# EasyEDA Pro project V2.3.2 Core.epro, schematic V2.3.2 Schematic

## Sheets
1 Network MCU: Board Name: V2.3.2 Core; Create Date: 2024-07-26; Page Name: Network MCU; Project Name: Access Control Core; Schematic Name: V2.3.2 Schematic; Update Date: 2025-06-26
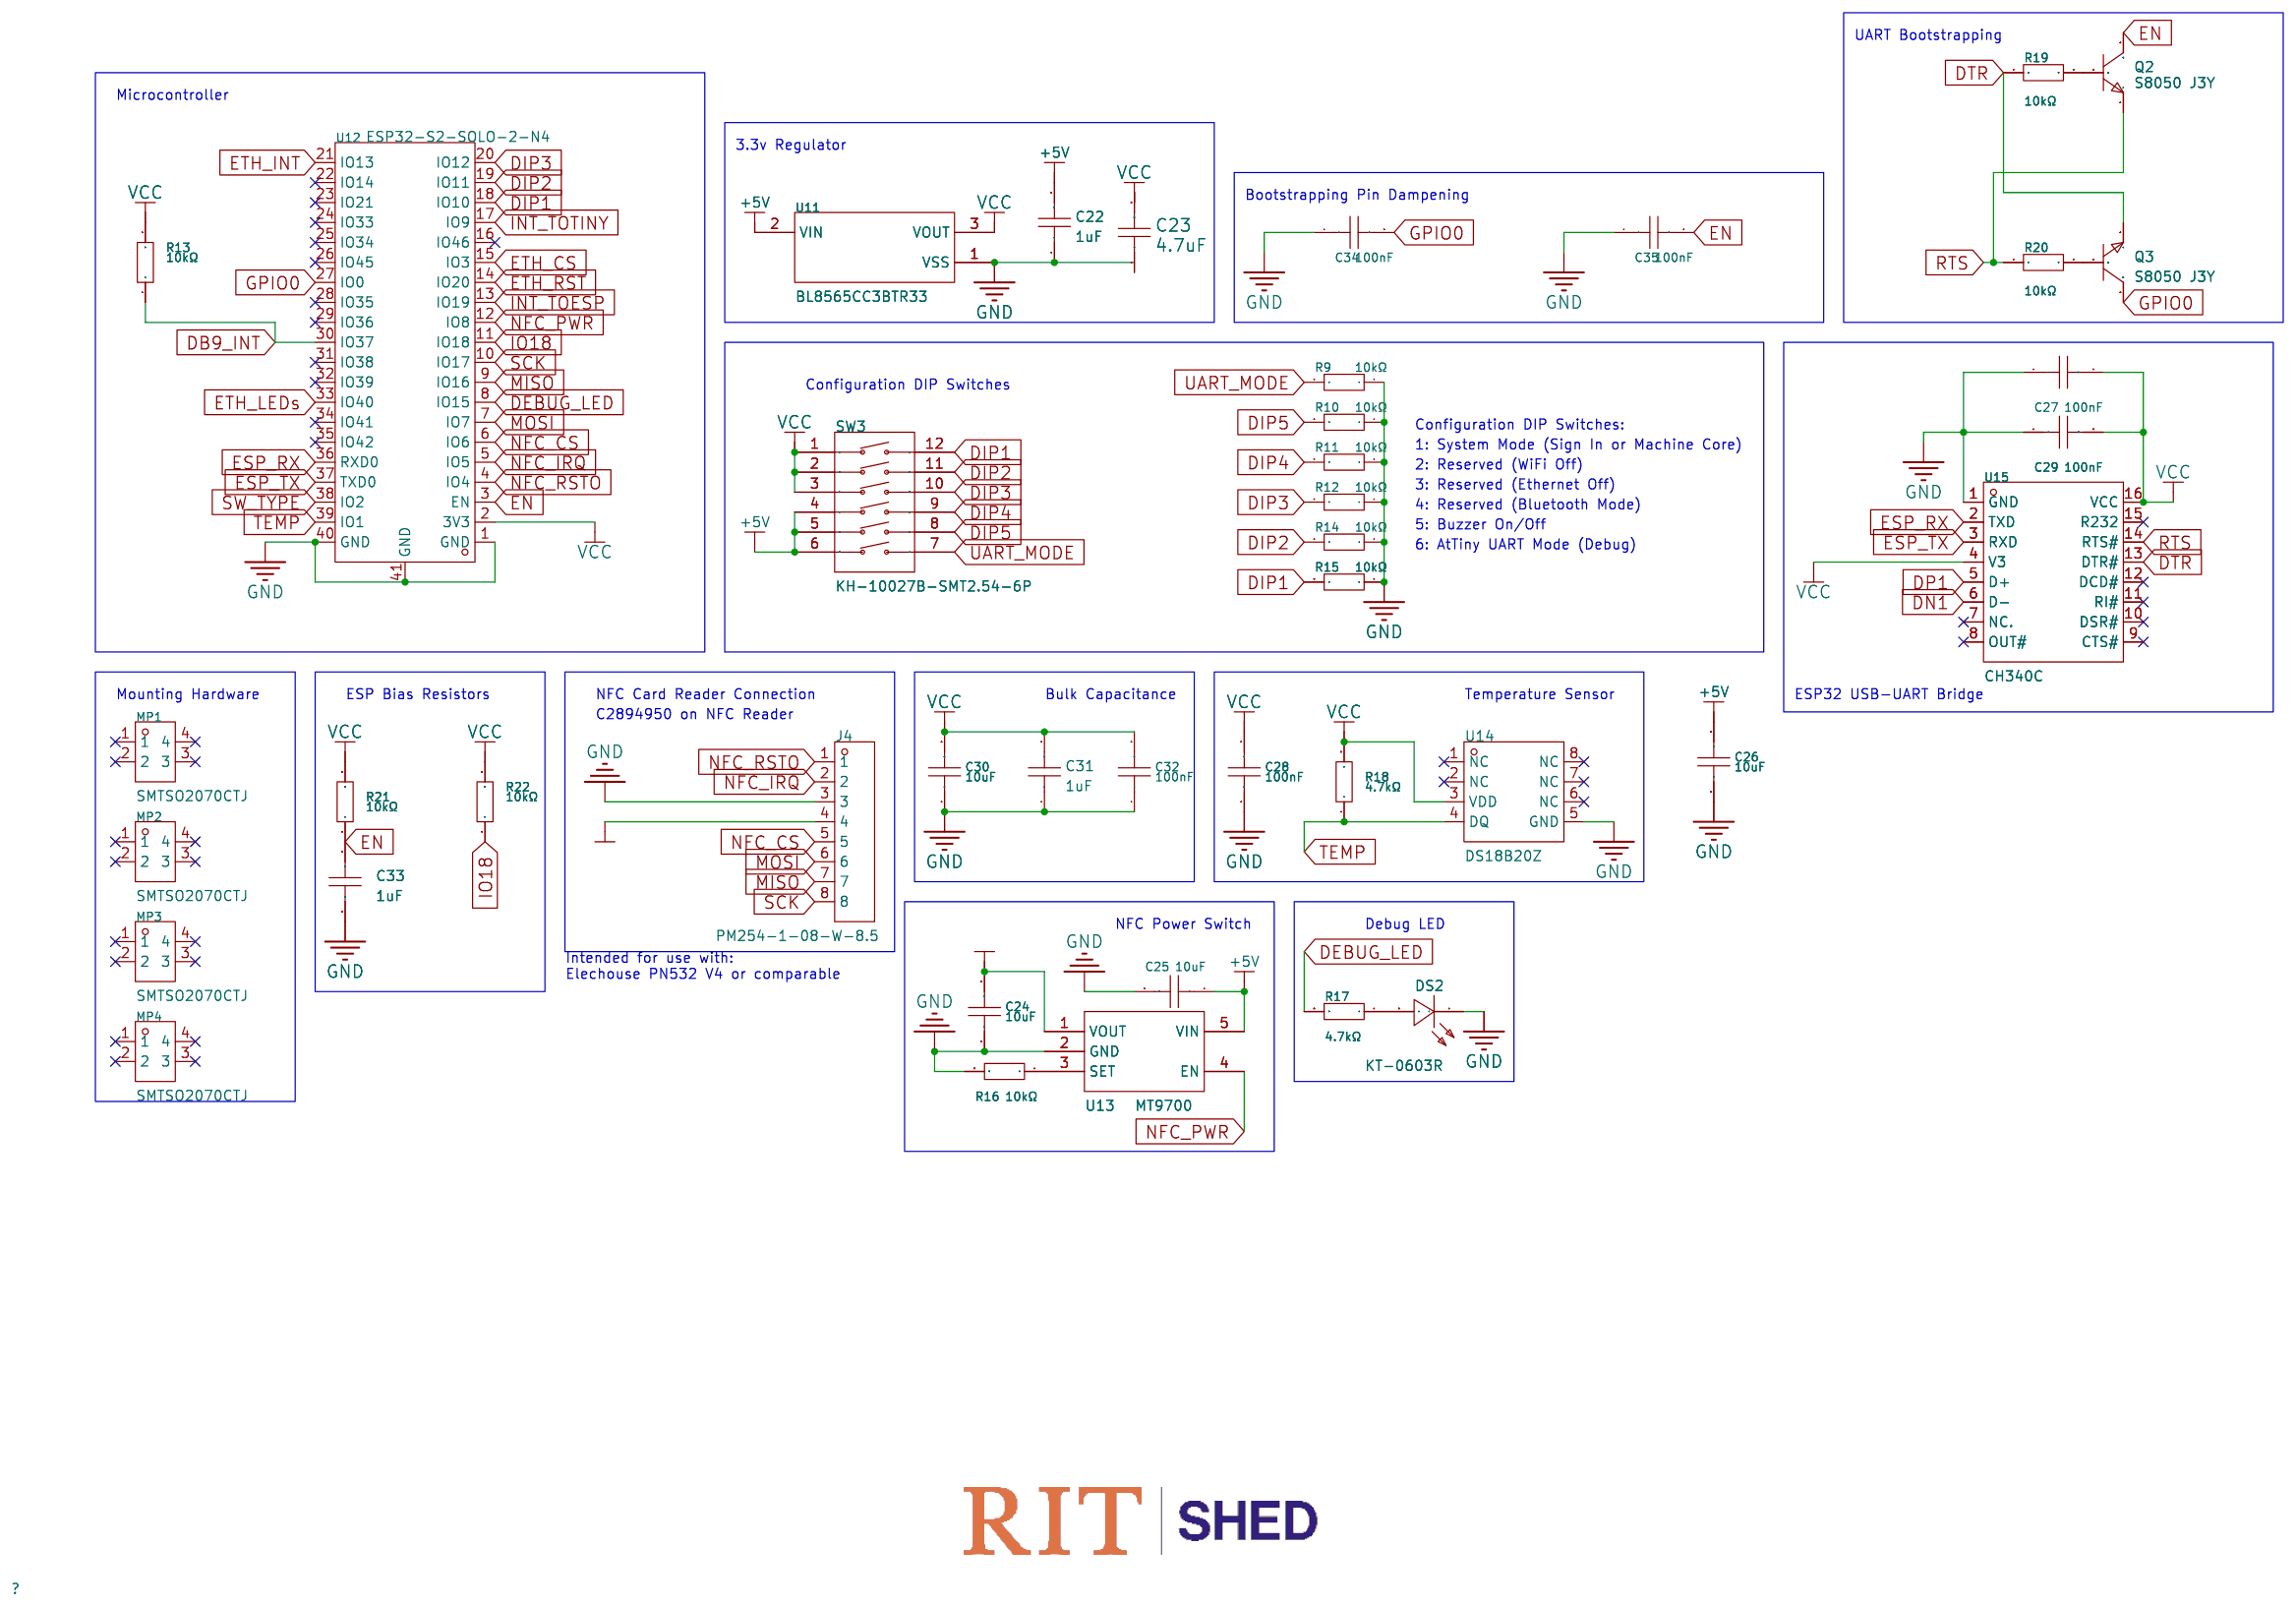
[diagram p0: Network MCU]
2 Front End: Page Name: Front End
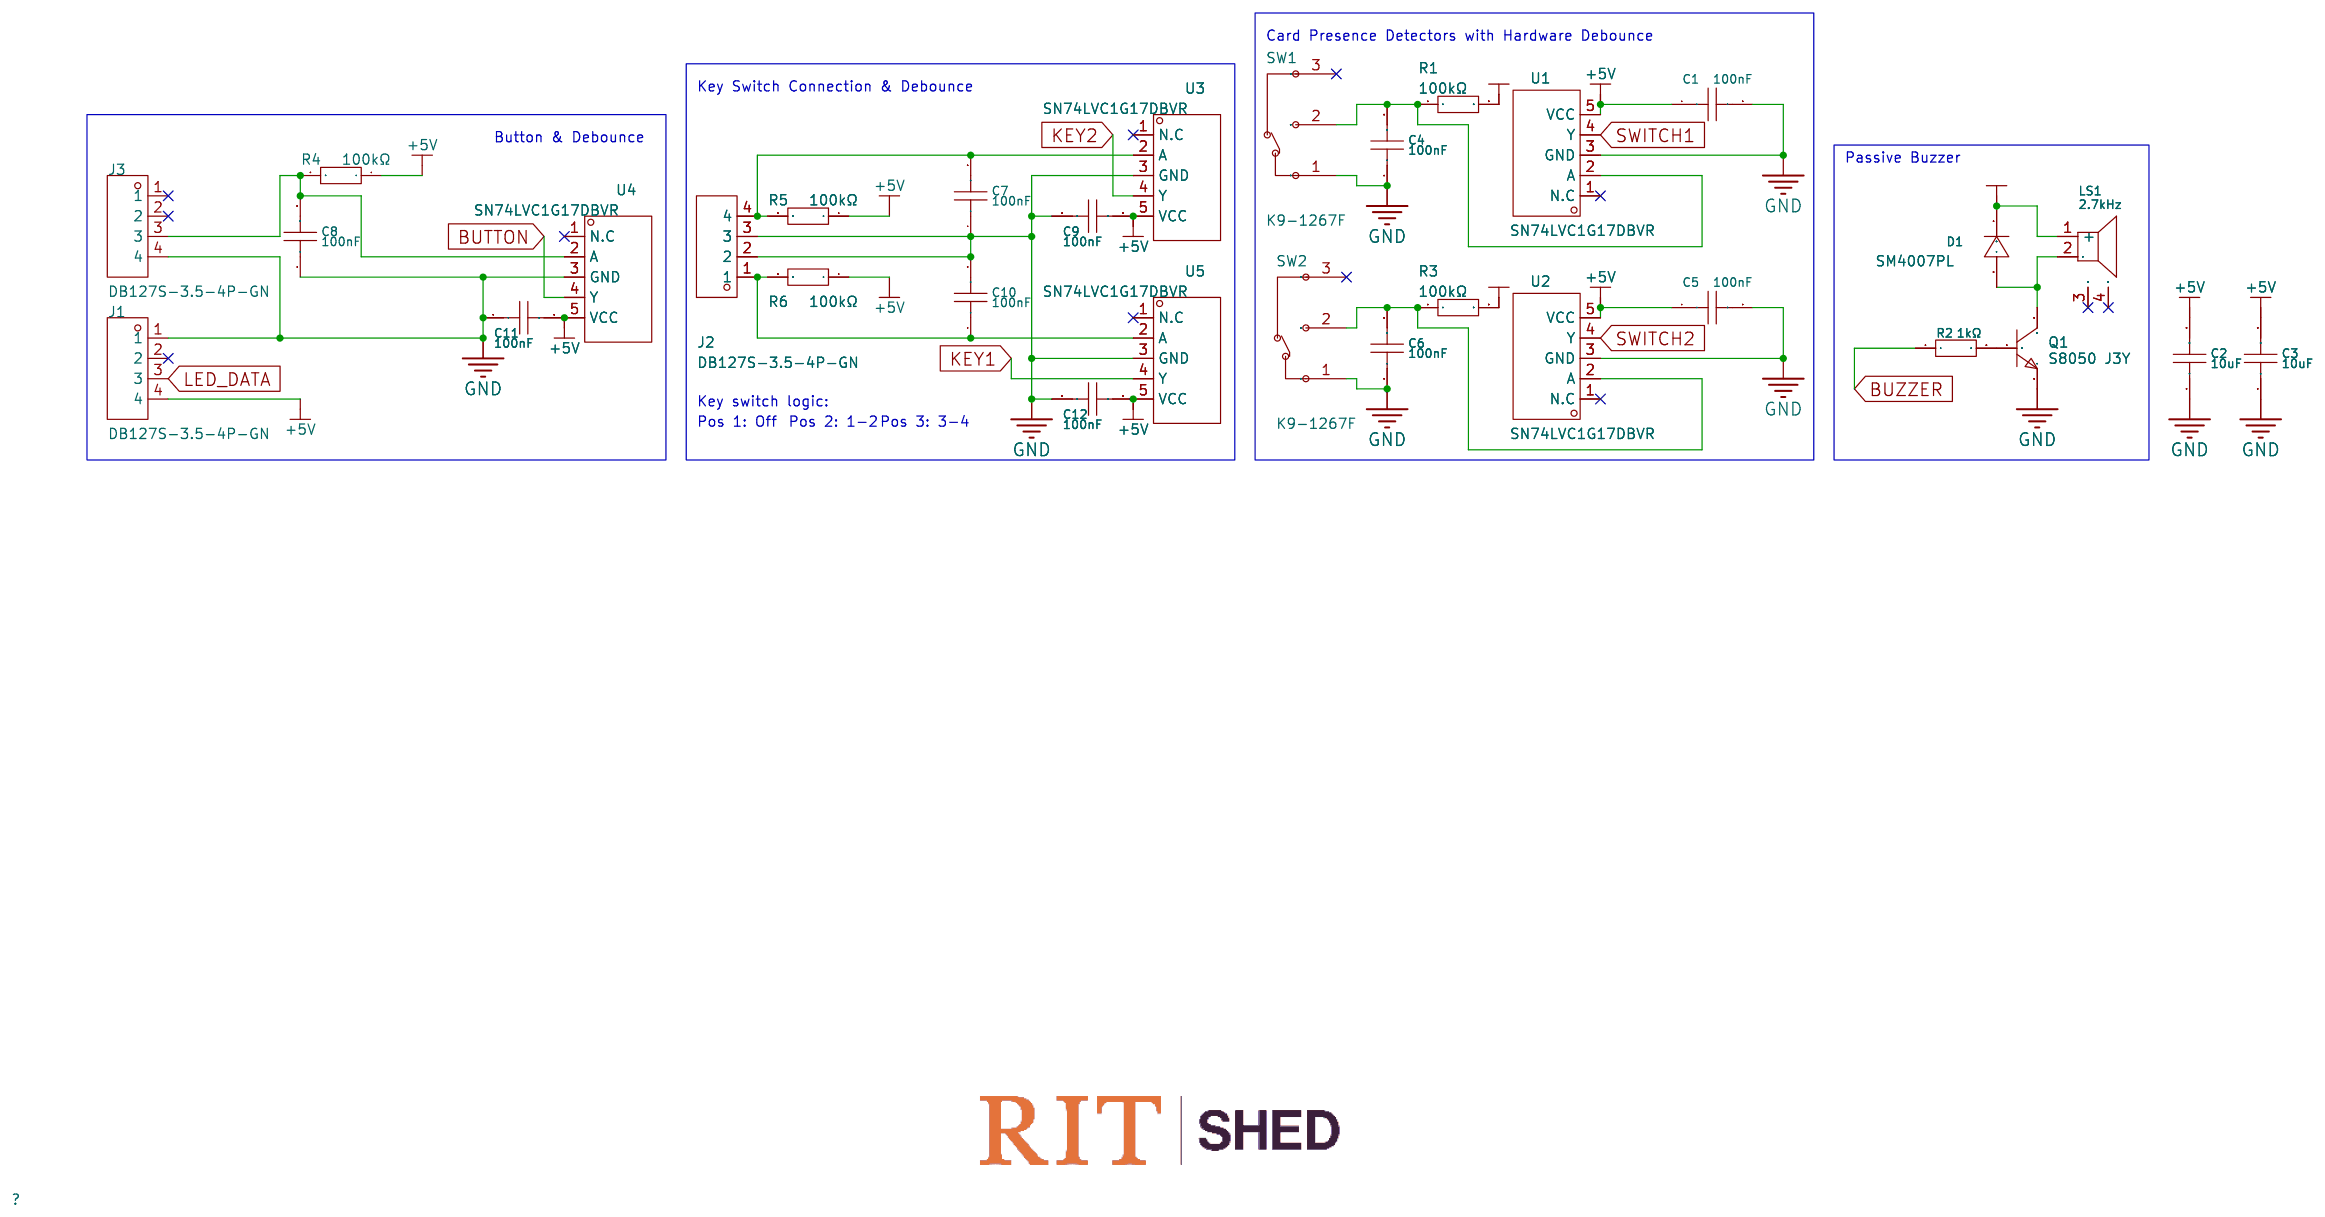
[diagram p1: Front End]
3 USB: Page Name: USB
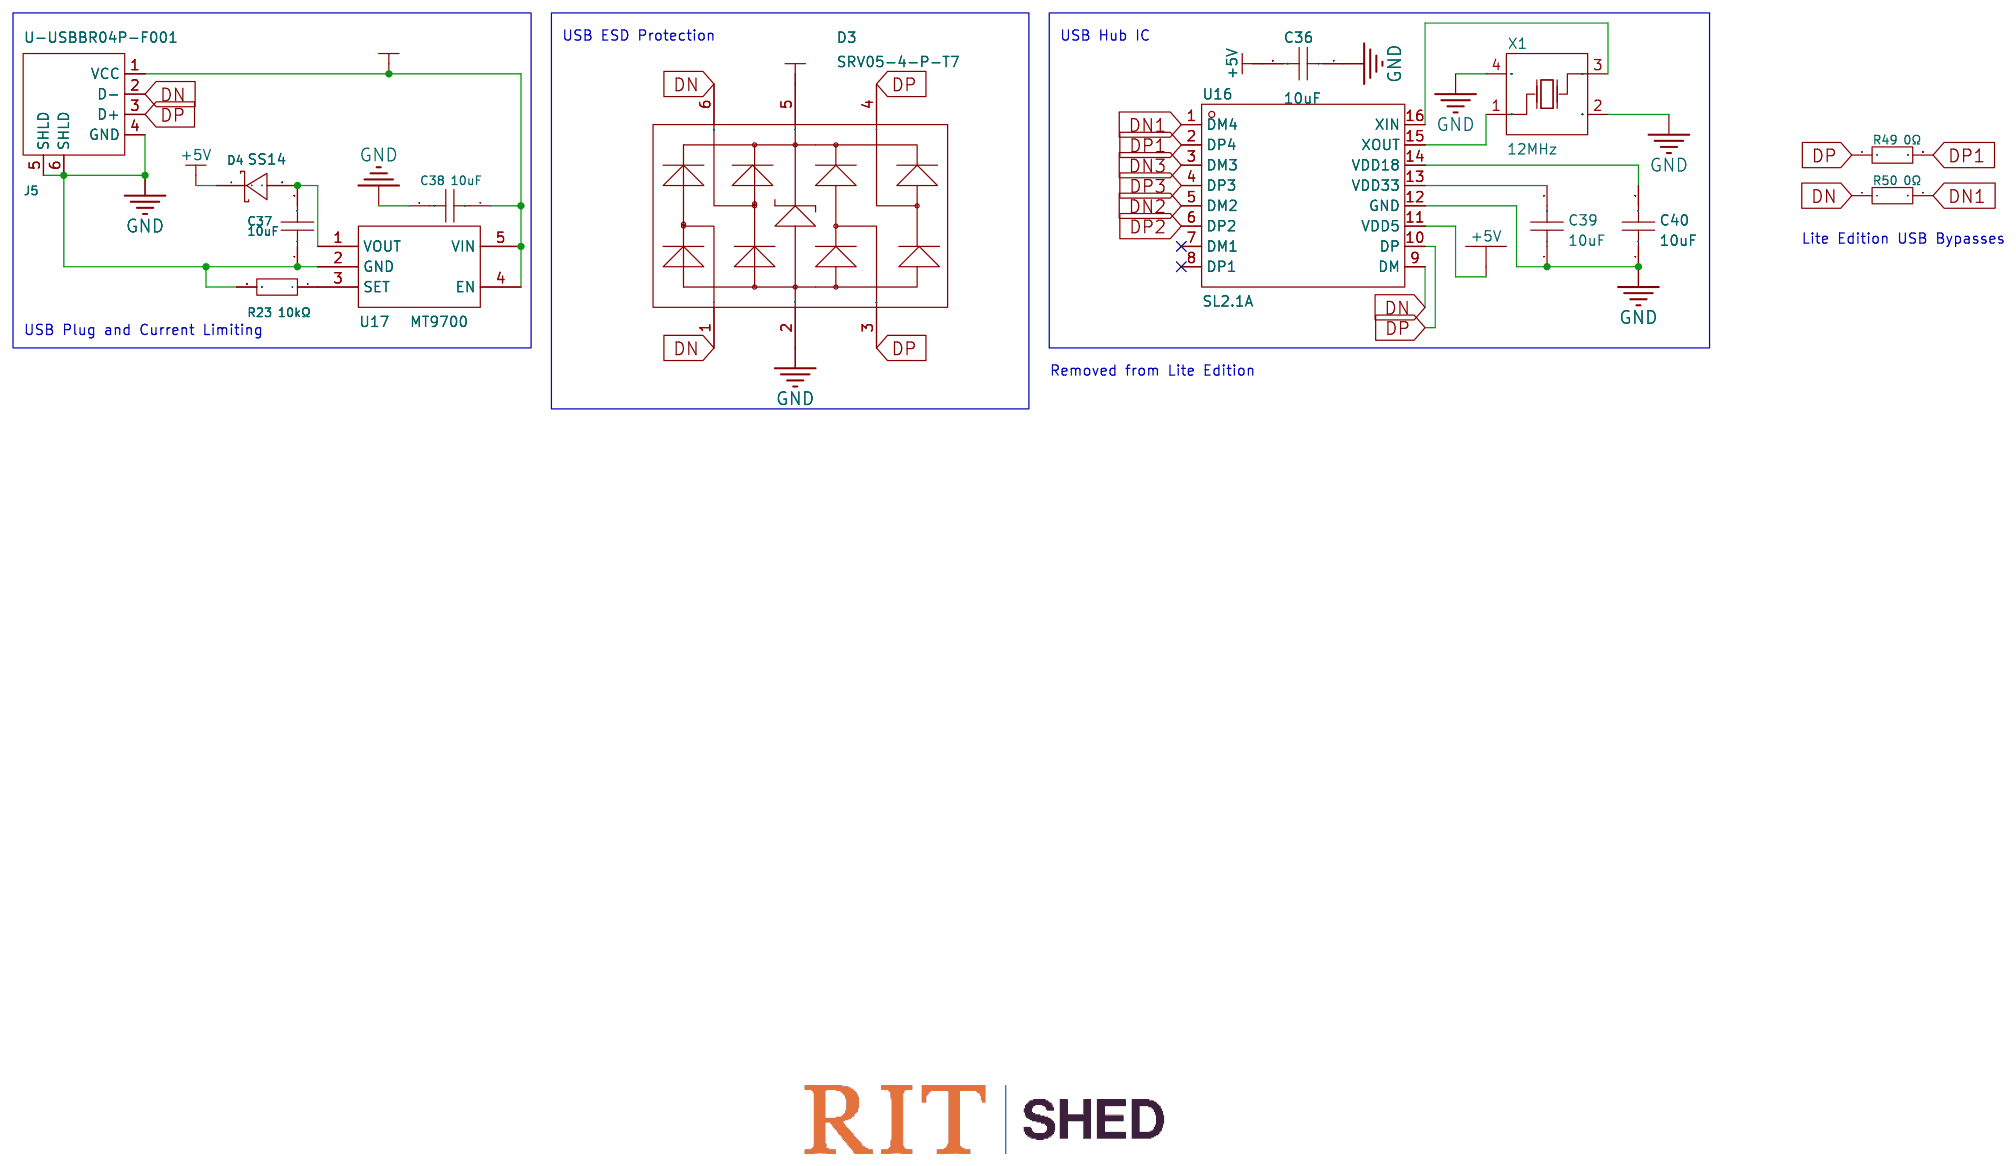
[diagram p2: USB]
4 Switch Interface: Page Name: Switch Interface
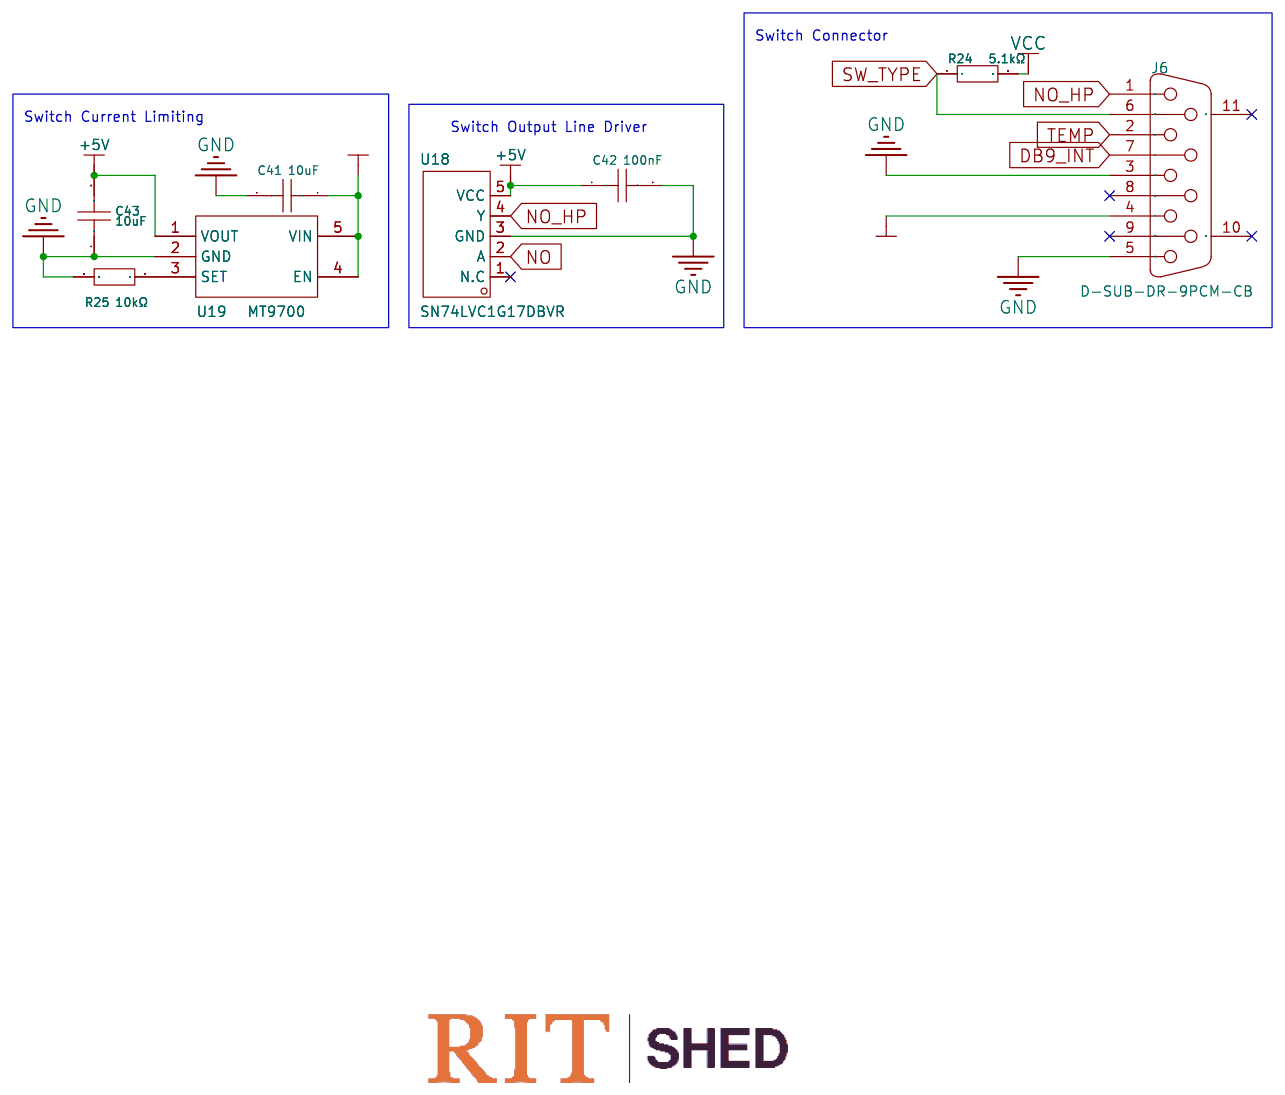
[diagram p3: Switch Interface]
5 Ethernet: Page Name: Ethernet
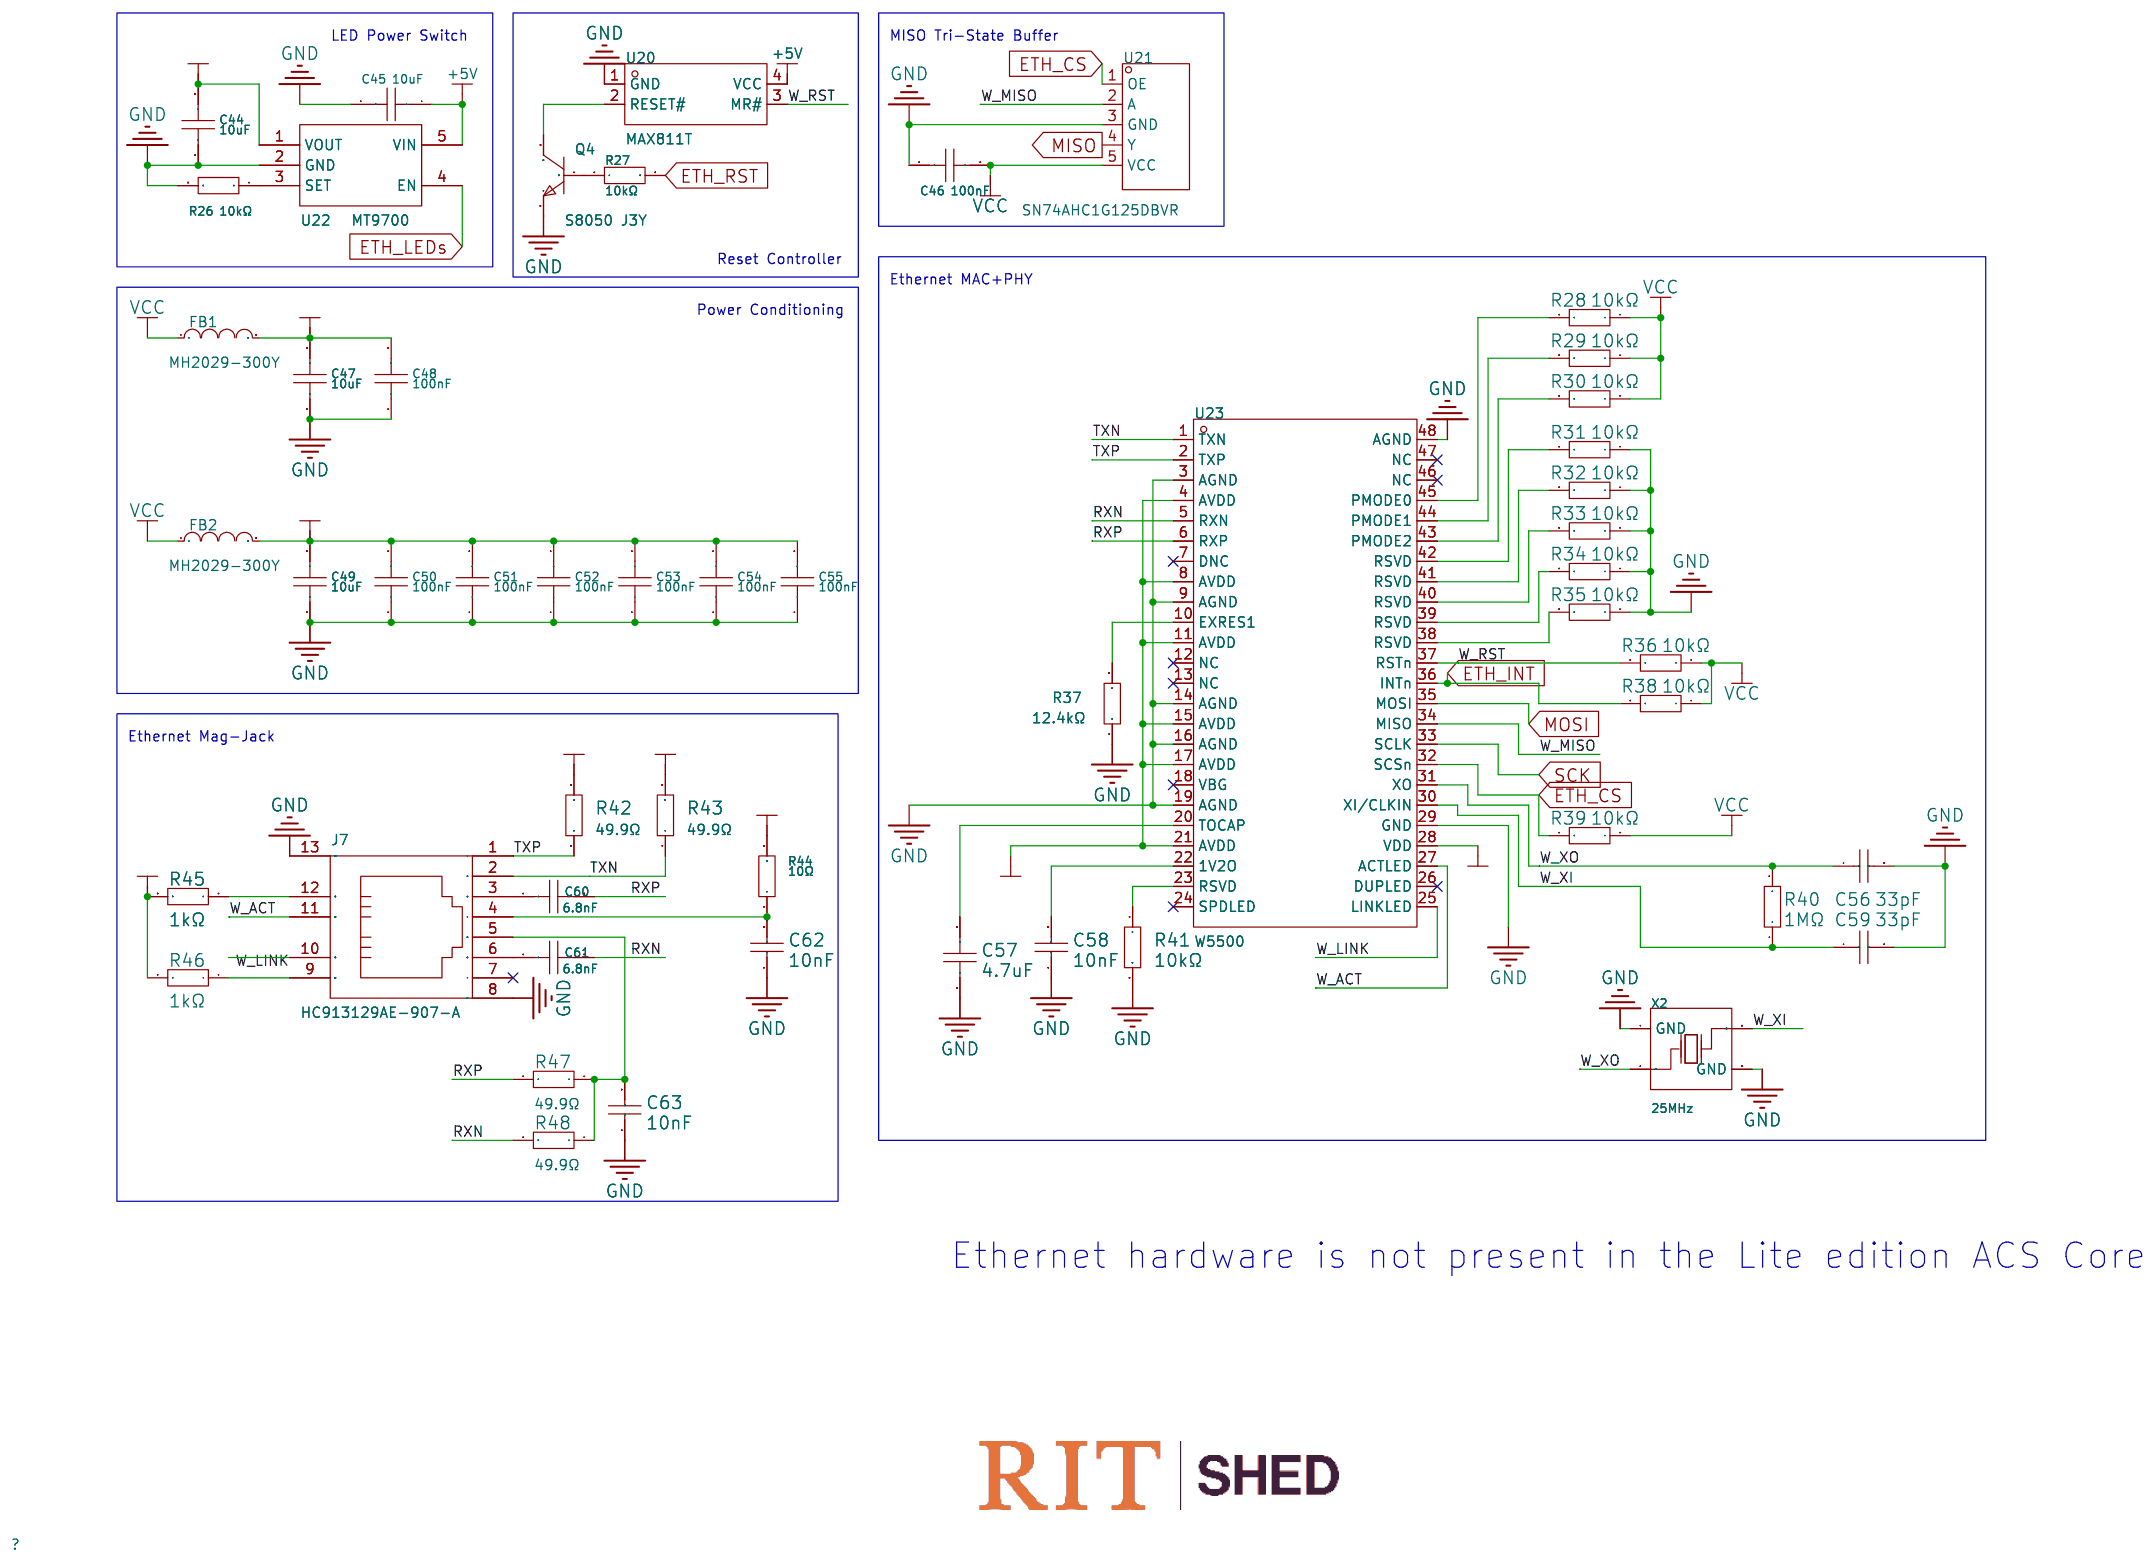
[diagram p4: Ethernet]
6 Front End MCU: Board Name: <System Assignment>; Page Name: Front End MCU
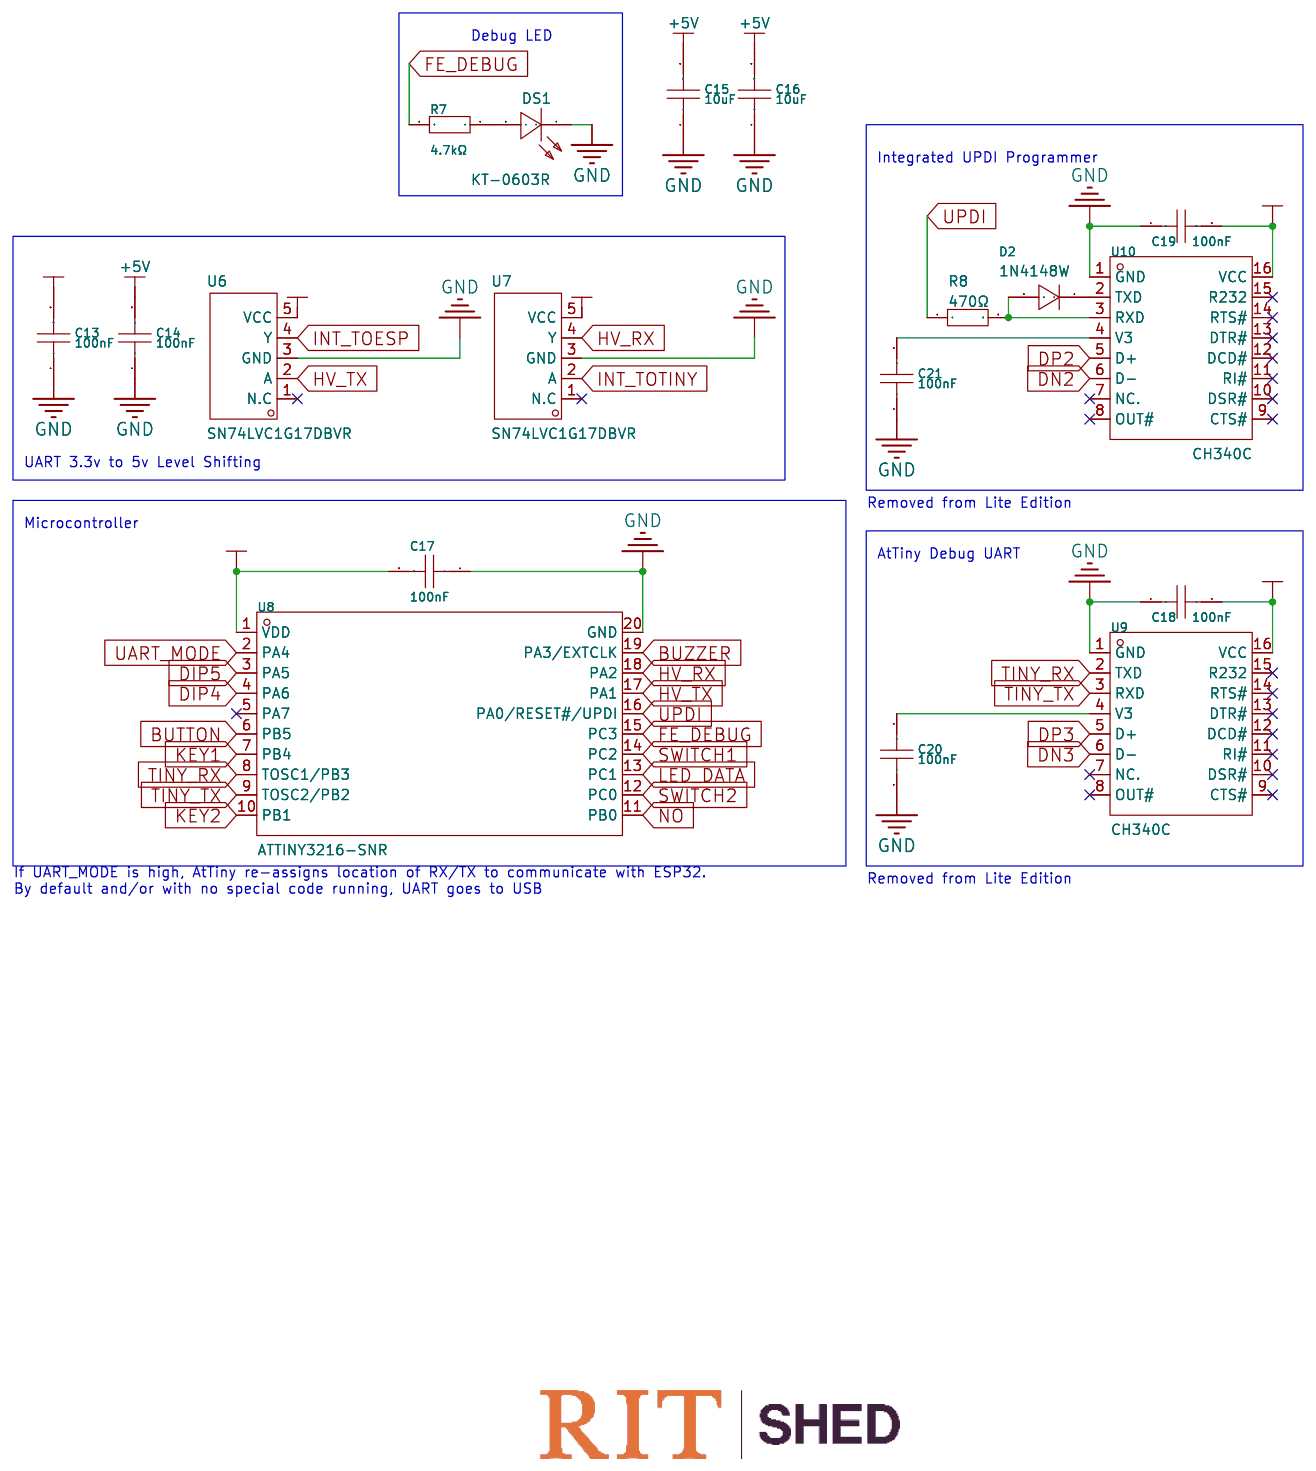
[diagram p5: Front End MCU]

## Parts
sheet Ethernet
C44  10uF  [C0603]  (no BOM)
C45  10uF  [C0603]  (no BOM)
C46  100nF  [C0603]  (no BOM)
C47  10uF  [C0603]  (no BOM)
C48  100nF  [C0603]  (no BOM)
C49  10uF  [C0603]  (no BOM)
C50  100nF  [C0603]  (no BOM)
C51  100nF  [C0603]  (no BOM)
C52  100nF  [C0603]  (no BOM)
C53  100nF  [C0603]  (no BOM)
C54  100nF  [C0603]  (no BOM)
C55  100nF  [C0603]  (no BOM)
C56  33pF  [C0603]  (no BOM)
C57  4.7uF  [C0603]  (no BOM)
C58  10nF  [C0603]  (no BOM)
C59  33pF  [C0603]  (no BOM)
C60  6.8nF  [C0603]  (no BOM)
C61  6.8nF  [C0603]  (no BOM)
C62  10nF  [C0603]  (no BOM)
C63  10nF  [C0603]  (no BOM)
FB1  MH2029-300Y  [L0805]  (no BOM)
FB2  MH2029-300Y  [L0805]  (no BOM)
J7  HC913129AE-907-A  [RJ45-TH_HC911102A-904-A]  (no BOM)
Q4  S8050 J3Y  [SOT-23-3_L3.0-W1.7-P0.95-LS2.9-BR]  (no BOM)
R26  10kΩ  [R0603]  (no BOM)
R27  10kΩ  [R0603]  (no BOM)
R28  10kΩ  [R0603]  (no BOM)
R29  10kΩ  [R0603]  (no BOM)
R30  10kΩ  [R0603]  (no BOM)
R31  10kΩ  [R0603]  (no BOM)
R32  10kΩ  [R0603]  (no BOM)
R33  10kΩ  [R0603]  (no BOM)
R34  10kΩ  [R0603]  (no BOM)
R35  10kΩ  [R0603]  (no BOM)
R36  10kΩ  [R0603]  (no BOM)
R37  12.4kΩ  [R0603]  (no BOM)
R38  10kΩ  [R0603]  (no BOM)
R39  10kΩ  [R0603]  (no BOM)
R40  1MΩ  [R0603]  (no BOM)
R41  10kΩ  [R0603]  (no BOM)
R42  49.9Ω  [R0603]  (no BOM)
R43  49.9Ω  [R0603]  (no BOM)
R44  10Ω  [R0603]  (no BOM)
R45  1kΩ  [R0603]  (no BOM)
R46  1kΩ  [R0603]  (no BOM)
R47  49.9Ω  [R0603]  (no BOM)
R48  49.9Ω  [R0603]  (no BOM)
U20  MAX811T  [SOT-143-4_L2.9-W1.3-P1.90-LS2.4-BL-1]  (no BOM)
U21  SN74AHC1G125DBVR  [SOT-23-5_L3.0-W1.7-P0.95-LS2.8-BR]  (no BOM)
U22  MT9700  [SOT-23-5_L3.0-W1.7-P0.95-LS2.8-BR]  (no BOM)
U23  W5500  [LQFP-48_L7.0-W7.0-P0.50-LS9.0-BL]  (no BOM)
X2  25MHz  [CRYSTAL-SMD_4P-L2.5-W2.0-BL]  (no BOM)
sheet Front End MCU
C13  100nF  [C0603]
C14  100nF  [C0603]
C15  10uF  [C0603]
C16  10uF  [C0603]
C17  100nF  [C0603]
C18  100nF  [C0603]  (no BOM)
C19  100nF  [C0603]  (no BOM)
C20  100nF  [C0603]  (no BOM)
C21  100nF  [C0603]  (no BOM)
D2  1N4148W  [SOD-123F_L2.7-W1.6-LS3.8-RD]  (no BOM)
DS1  KT-0603R  [LED0603-RD]
R7  4.7kΩ  [R0603]
R8  470Ω  [R0603]  (no BOM)
U6  SN74LVC1G17DBVR  [SOT-23-5_L3.0-W1.7-P0.95-LS2.8-BR]
U7  SN74LVC1G17DBVR  [SOT-23-5_L3.0-W1.7-P0.95-LS2.8-BR]
U8  ATTINY3216-SNR  [SOIC-20_L12.8-W7.5-P1.27-LS10.3-BL]
U9  CH340C  [SOP-16_L10.0-W3.9-P1.27-LS6.0-BL]  (no BOM)
U10  CH340C  [SOP-16_L10.0-W3.9-P1.27-LS6.0-BL]  (no BOM)
sheet Front End
C1  100nF  [C0603]
C2  10uF  [C0603]
C3  10uF  [C0603]
C4  100nF  [C0603]
C5  100nF  [C0603]
C6  100nF  [C0603]
C7  100nF  [C0603]
C8  100nF  [C0603]
C9  100nF  [C0603]
C10  100nF  [C0603]
C11  100nF  [C0603]
C12  100nF  [C0603]
D1  SM4007PL  [SOD-123F_L2.8-W1.8-LS3.7-RD]
J1  DB127S-3.5-4P-GN  [CONN-TH_4P-P3.50_DIBO_DB127S-3.5-4P-GN]
J2  DB127S-3.5-4P-GN  [CONN-TH_4P-P3.50_DIBO_DB127S-3.5-4P-GN]
J3  DB127S-3.5-4P-GN  [CONN-TH_4P-P3.50_DIBO_DB127S-3.5-4P-GN]
LS1  2.7kHz  [BUZ-SMD_4P-L8.5-W8.5-P8.50-TL]
Q1  S8050 J3Y  [SOT-23-3_L3.0-W1.7-P0.95-LS2.9-BR]
R1  100kΩ  [R0603]
R2  1kΩ  [R0603]
R3  100kΩ  [R0603]
R4  100kΩ  [R0603]
R5  100kΩ  [R0603]
R6  100kΩ  [R0603]
SW1  K9-1267F  [SW-TH_K9-1267F]
SW2  K9-1267F  [SW-TH_K9-1267F]
U1  SN74LVC1G17DBVR  [SOT-23-5_L3.0-W1.7-P0.95-LS2.8-BR]
U2  SN74LVC1G17DBVR  [SOT-23-5_L3.0-W1.7-P0.95-LS2.8-BR]
U3  SN74LVC1G17DBVR  [SOT-23-5_L3.0-W1.7-P0.95-LS2.8-BR]
U4  SN74LVC1G17DBVR  [SOT-23-5_L3.0-W1.7-P0.95-LS2.8-BR]
U5  SN74LVC1G17DBVR  [SOT-23-5_L3.0-W1.7-P0.95-LS2.8-BR]
sheet Network MCU
C22  1uF  [C0603]
C23  4.7uF  [C0603]
C24  10uF  [C0603]
C25  10uF  [C0603]
C26  10uF  [C0603]
C27  100nF  [C0603]
C28  100nF  [C0603]
C29  100nF  [C0603]
C30  10uF  [C0603]
C31  1uF  [C0603]
C32  100nF  [C0603]
C33  1uF  [C0603]
C34  100nF  [C0603]
C35  100nF  [C0603]
DS2  KT-0603R  [LED0603-RD]
J4  PM254-1-08-W-8.5  [HDR-TH_8P-P2.54-H-F-W10.0-N]
MP1  SMTSO2070CTJ  [SMD_BD5.6-L5.6-W5.6-D3.6]
MP2  SMTSO2070CTJ  [SMD_BD5.6-L5.6-W5.6-D3.6]
MP3  SMTSO2070CTJ  [SMD_BD5.6-L5.6-W5.6-D3.6]
MP4  SMTSO2070CTJ  [SMD_BD5.6-L5.6-W5.6-D3.6]
Q2  S8050 J3Y  [SOT-23-3_L3.0-W1.7-P0.95-LS2.9-BR]
Q3  S8050 J3Y  [SOT-23-3_L3.0-W1.7-P0.95-LS2.9-BR]
R9  10kΩ  [R0603]
R10  10kΩ  [R0603]
R11  10kΩ  [R0603]
R12  10kΩ  [R0603]
R13  10kΩ  [R0603]
R14  10kΩ  [R0603]
R15  10kΩ  [R0603]
R16  10kΩ  [R0603]
R17  4.7kΩ  [R0603]
R18  4.7kΩ  [R0603]
R19  10kΩ  [R0603]
R20  10kΩ  [R0603]
R21  10kΩ  [R0603]
R22  10kΩ  [R0603]
SW3  KH-10027B-SMT2.54-6P  [SW-SMD_KINGHELM_KH-10027B-SMT2.54-6P]
U11  BL8565CC3BTR33  [SOT-89-3_L4.5-W2.5-P1.50-LS4.2-BR]
U12  2.4GHz  [WIRELM-SMD_ESP32-S3-WROOM-1]
U13  MT9700  [SOT-23-5_L3.0-W1.7-P0.95-LS2.8-BR]
U14  DS18B20Z  [SOP-8_L4.9-W3.9-P1.27-LS6.0-BL]
U15  CH340C  [SOP-16_L10.0-W3.9-P1.27-LS6.0-BL]
sheet Switch Interface
C41  10uF  [C0603]
C42  100nF  [C0603]
C43  10uF  [C0603]
J6  D-SUB-DR-9PCM-CB  [DB9-TH_D-SUB-DR-9PCM-CB]
R24  5.1kΩ  [R0603]
R25  10kΩ  [R0603]
U18  SN74LVC1G17DBVR  [SOT-23-5_L3.0-W1.7-P0.95-LS2.8-BR]
U19  MT9700  [SOT-23-5_L3.0-W1.7-P0.95-LS2.8-BR]
sheet USB
C36  10uF  [C0603]  (no BOM)
C37  10uF  [C0603]
C38  10uF  [C0603]
C39  10uF  [C0603]  (no BOM)
C40  10uF  [C0603]  (no BOM)
D3  SRV05-4-P-T7  [SOT-23-6_L2.9-W1.6-P0.95-LS2.8-BR]
D4  SS14  [SMA_L4.2-W2.6-LS5.3-RD]
J5  U-USBBR04P-F001  [USB-B-TH_U241-041N-1BR85-1]
R23  10kΩ  [R0603]
R49  0Ω  [R0603]
R50  0Ω  [R0603]
U16  SL2.1A  [SOP-16_L10.0-W3.9-P1.27-LS6.0-BL]  (no BOM)
U17  MT9700  [SOT-23-5_L3.0-W1.7-P0.95-LS2.8-BR]
X1  12MHz  [OSC-SMD_4P-L3.2-W2.5-BL]  (no BOM)

## Library data of the parts
C2 C3 C15 C16 C24-C26 C30 C37 C38 C41 C43-C45 C47 C49 = CL10A106MA8NRNC: Capacitance: Tolerance:±20% Tolerance:±20% Voltage Rated: Temperature Coefficient:; LCSC Part Name: 10uF ±20% 25V; Supplier Part: C96446; Manufacturer: SAMSUNG(三星); Supplier Footprint: 0603; JLCPCB Part Class: Basic Part; Datasheet: https://atta.szlcsc.com/upload/public/pdf/source/20160218/1457707763339.pdf; Supplier: LCSC; Tolerance: ±20%
C1 C4-C14 C17-C21 C27-C29 C32 C34 C35 C42 C46 C48 C50-C55 = CC0603KRX7R9BB104: Capacitance: Tolerance:±10% Tolerance:±10% Voltage Rated: Temperature Coefficient:; LCSC Part Name: 100nF ±10% 50V; Supplier Part: C14663; Manufacturer: YAGEO(国巨); Supplier Footprint: 0603; JLCPCB Part Class: Basic Part; Datasheet: https://atta.szlcsc.com/upload/public/pdf/source/20180910/C282072_33301C7F631E79921B82A8DAC6BCC5B3.pdf; Supplier: LCSC; Tolerance: ±10%
C56 C59 = CL10C330JB8NNNC: Capacitance: Tolerance:±5% Tolerance:±5% Voltage Rated: Temperature Coefficient:; LCSC Part Name: 33pF ±5% 50V; Supplier Part: C1663; Manufacturer: SAMSUNG(三星); Supplier Footprint: 0603; JLCPCB Part Class: Basic Part; Datasheet: https://atta.szlcsc.com/upload/public/pdf/source/20160218/1457707763339.pdf; Supplier: LCSC; Tolerance: ±5%
C23 C57 = CL10A475KO8NNNC: Capacitance: Tolerance:±10% Tolerance:±10% Voltage Rated: Temperature Coefficient:; LCSC Part Name: 4.7uF ±10% 16V; Supplier Part: C19666; Manufacturer: SAMSUNG(三星); Supplier Footprint: 0603; JLCPCB Part Class: Basic Part; Datasheet: https://atta.szlcsc.com/upload/public/pdf/source/20160218/1457707763339.pdf; Supplier: LCSC; Tolerance: ±10%
C58 C62 C63 = 0603B103K500NT: Capacitance:10nF Tolerance:±10% Tolerance:±10% Voltage Rated: Temperature Coefficient:; LCSC Part Name: 10nF ±10% 50V; Supplier Part: C57112; Manufacturer: FH(风华); Supplier Footprint: 0603; JLCPCB Part Class: Basic Part; Datasheet: https://atta.szlcsc.com/upload/public/pdf/source/20200305/C486355_26A10D38EF8C2A5C37091D0039909270.pdf; Supplier: LCSC; Tolerance: ±10%
C60 C61 = C1608X7R2A682KT000N: Capacitance: Tolerance:±10% Tolerance:±10% Voltage Rated: Temperature Coefficient:; LCSC Part Name: 6.8nF ±10% 100V; Supplier Part: C694293; Manufacturer: TDK; Supplier Footprint: 0603; JLCPCB Part Class: Extended Part; Datasheet: https://atta.szlcsc.com/upload/public/pdf/source/20191129/C465875_2B14C4D62A20D308712483249251ED98.pdf; Supplier: LCSC; Tolerance: ±10%
FB1 FB2 = MH2029-300Y: Impedance @ Frequency:30Ω@100MHz Tolerance:±25% Tolerance:±25% DC Resistance:25mΩ Current Rating:3A Circuits:1; LCSC Part Name: 单路 0805磁珠 阻抗30Ω@100MHz; Supplier Part: C840593; Manufacturer: BOURNS; Supplier Footprint: 0805; JLCPCB Part Class: Extended Part; Datasheet: https://atta.szlcsc.com/upload/public/pdf/source/20200907/C780182_6AA2A849D07FE675FBDEC0D82719ED6E.pdf; Supplier: LCSC; Impedance @ Frequency: 30Ω@100MHz; Tolerance: ±25%; DC Resistance: 25mΩ; Current Rating: 3A; Circuits: 1
J7 = HC913129AE-907-A: Connector Type:RJ45Receptacle Number of Ports:1 Mounting Style:Right-Angle Shielding:有屏蔽 LED:WithLED Contact Material:Phosphor bronze Contact Plating:Gold Operating Temperature Range:-40℃~+85℃ Operating Temperature Range:-40℃~+85℃ Soldering Temperature(Ma; LCSC Part Name: 弯插 带LED; Supplier Part: C5341218; Manufacturer: HCTL(华灿天禄); Supplier Footprint: 插件; JLCPCB Part Class: Extended Part; Datasheet: https://atta.szlcsc.com/upload/public/pdf/source/20230620/1EF30919FD4FC73383A5674A58476AE5.pdf; Supplier: LCSC; Connector Type: RJ45Receptacle; Number of Ports: 1; Mounting Style: Right-Angle; Shielding: 有屏蔽; LED: WithLED; Contact Material: Phosphor bronze; Contact Plating: Gold; Operating Temperature Range: -40℃~+85℃; Soldering Temperature(Max): 260℃@5S
Q1-Q4 = S8050 J3Y_C2146: Transistor Type: Collector Current (Ic): Collector-Emitter Breakdown Voltage (Vceo): Power Dissipation (Pd): DC Current Gain (hFE@Ic,Vce):200@50mA,1V DC Current Gain (hFE@Ic,Vce):200@50mA,1V Transition Frequency (fT):150MHz Collector Cut-Off Current (Icbo; LCSC Part Name: S8050 J3Y(RANGE:200-350) H档(200-350); Supplier Part: C2146; Manufacturer: CJ(江苏长电/长晶); Supplier Footprint: SOT-23; JLCPCB Part Class: Basic Part; Datasheet: https://atta.szlcsc.com/upload/public/pdf/source/20140809/1457707209234.pdf; Supplier: LCSC; DC Current Gain (hFE@Ic,Vce): 200@50mA,1V; Transition Frequency (fT): 150MHz; Collector Cut-Off Current (Icbo): 100nA; Collector-Emitter Saturation Voltage (VCE(sat)@Ic,Ib): 600mV@500mA,50mA
R9-R16 R19-R23 R25-R36 R38 R39 R41 = 0603WAF1002T5E: Type:Thick Film Resistors Resistance:10kΩ Tolerance:±1% Tolerance:±1% Power(Watts): Overload Voltage (Max): Temperature Coefficient:±100ppm/℃ Temperature Coefficient:±100ppm/℃ Operating Temperature Range:-55℃~+155℃ Operating Temperature Range:-55℃~+155℃; LCSC Part Name: 厚膜电阻 10kΩ ±1% 100mW; Supplier Part: C25804; Manufacturer: UNI-ROYAL(厚声); Supplier Footprint: 0603; JLCPCB Part Class: Basic Part; Datasheet: https://atta.szlcsc.com/upload/public/pdf/source/20200306/C422600_1E6D84923E4A46A82E41ADD87F860B5C.pdf; Supplier: LCSC; Type: Thick Film Resistors; Tolerance: ±1%; Temperature Coefficient: ±100ppm/℃; Operating Temperature Range: -55℃~+155℃
R37 = RTT031242FTP: Type:Thick Film Resistors Resistance: Tolerance:±1% Tolerance:±1% Power(Watts): Overload Voltage (Max): Temperature Coefficient:±100ppm/℃ Temperature Coefficient:±100ppm/℃ Operating Temperature Range:-55℃~+155℃ Operating Temperature Range:-55℃~+155℃; LCSC Part Name: 厚膜电阻 12.4kΩ ±1% 100mW; Supplier Part: C103261; Manufacturer: RALEC(旺诠); Supplier Footprint: 0603; JLCPCB Part Class: Extended Part; Datasheet: https://atta.szlcsc.com/upload/public/pdf/source/20191219/C158410_884373A5B7E1BC76BF57BC45A946C093.pdf; Supplier: LCSC; Type: Thick Film Resistors; Tolerance: ±1%; Temperature Coefficient: ±100ppm/℃; Operating Temperature Range: -55℃~+155℃
R40 = 0603WAF1004T5E: Type:Thick Film Resistors Resistance:1MΩ Tolerance:±1% Tolerance:±1% Power(Watts): Overload Voltage (Max): Temperature Coefficient:±100ppm/℃ Temperature Coefficient:±100ppm/℃ Operating Temperature Range:-55℃~+155℃ Operating Temperature Range:-55℃~+155℃; LCSC Part Name: 1MΩ ±1% 100mW 厚膜电阻; Supplier Part: C22935; Manufacturer: UNI-ROYAL(厚声); Supplier Footprint: 0603; JLCPCB Part Class: Basic Part; Datasheet: https://atta.szlcsc.com/upload/public/pdf/source/20200306/C422600_1E6D84923E4A46A82E41ADD87F860B5C.pdf; Supplier: LCSC; Type: Thick Film Resistors; Tolerance: ±1%; Temperature Coefficient: ±100ppm/℃; Operating Temperature Range: -55℃~+155℃
R42 R43 R47 R48 = RC0603DR-0749R9L: 100mW Thick Film Resistors ±100ppm/℃ ±0.5% 49.9Ω 0603  Chip Resistor - Surface Mount ROHS; LCSC Part Name: C859049; Supplier Part: C859049; Manufacturer: UNI-ROYAL(厚声); Manufacturer Part: 0603WAF1002T5E; Supplier Footprint: 0603; JLCPCB Part Class: Extended Part; Datasheet: https://atta.szlcsc.com/upload/public/pdf/source/20200306/C422600_1E6D84923E4A46A82E41ADD87F860B5C.pdf; Supplier: LCSC; Type: Thick Film Resistors; Tolerance: ±1%; Temperature Coefficient: ±100ppm/℃; Operating Temperature Range: -55℃~+155℃
R44 = 0603WAF100JT5E: Type:Thick Film Resistors Resistance:10Ω Tolerance:±1% Tolerance:±1% Power(Watts): Overload Voltage (Max): Temperature Coefficient:±400ppm/℃ Temperature Coefficient:±400ppm/℃ Operating Temperature Range:-55℃~+155℃ Operating Temperature Range:-55℃~+155℃; LCSC Part Name: 10Ω ±1% 100mW 厚膜电阻; Supplier Part: C22859; Manufacturer: UNI-ROYAL(厚声); Supplier Footprint: 0603; JLCPCB Part Class: Basic Part; Datasheet: https://atta.szlcsc.com/upload/public/pdf/source/20200306/C422600_1E6D84923E4A46A82E41ADD87F860B5C.pdf; Supplier: LCSC; Type: Thick Film Resistors; Tolerance: ±1%; Temperature Coefficient: ±400ppm/℃; Operating Temperature Range: -55℃~+155℃
R2 R45 R46 = 0603WAF1001T5E: Type:Thick Film Resistors Resistance:1kΩ Tolerance:±1% Tolerance:±1% Power(Watts): Overload Voltage (Max): Temperature Coefficient:±100ppm/℃ Temperature Coefficient:±100ppm/℃ Operating Temperature Range:-55℃~+155℃ Operating Temperature Range:-55℃~+155℃; LCSC Part Name: 1kΩ ±1% 100mW 厚膜电阻; Supplier Part: C21190; Manufacturer: UNI-ROYAL(厚声); Supplier Footprint: 0603; JLCPCB Part Class: Basic Part; Datasheet: https://atta.szlcsc.com/upload/public/pdf/source/20200306/C422600_1E6D84923E4A46A82E41ADD87F860B5C.pdf; Supplier: LCSC; Type: Thick Film Resistors; Tolerance: ±1%; Temperature Coefficient: ±100ppm/℃; Operating Temperature Range: -55℃~+155℃
U20 = MAX811T: Supplier Part: C19631730; Manufacturer: TECH PUBLIC(台舟); Supplier Footprint: SOT-143; JLCPCB Part Class: Extended Part; Datasheet: https://wmsc.lcsc.com/wmsc/upload/file/pdf/v2/lcsc/2404012050_GR-MAX811T_C19631730.pdf; Supplier: LCSC
U21 = SN74AHC1G125DBVR: Input type:- output type:Tri-State Supply Voltage:2V~5.5V Supply Voltage:2V~5.5V Number of Elements:1 Number of Bits per Element:1 Sink Current:8mA Source Current:8mA Logic Family:74AHC Operating Temperature:-40℃~+125℃ Operating Temperature:-40℃~+125℃; Supplier Part: C7468; Manufacturer: TI(德州仪器); Supplier Footprint: SOT-23-5; JLCPCB Part Class: Extended Part; Datasheet: https://www.ti.com/cn/lit/gpn/sn74ahc1g125; Supplier: LCSC; output type: Tri-State; Supply Voltage: 2V~5.5V; Number of Elements: 1; Number of Bits per Element: 1; Sink Current: 8mA; Source Current: 8mA; Logic Family: 74AHC; Operating Temperature: -40℃~+125℃
U13 U17 U19 U22 = MT9700: Supplier Part: C89855; Manufacturer: 西安航天民芯; Supplier Footprint: SOT-23-5; JLCPCB Part Class: Extended Part; Datasheet: https://atta.szlcsc.com/upload/public/pdf/source/20170418/1492481333031.pdf; Supplier: LCSC
U23 = W5500: LCSC Part Name: 硬连线TCP/IP嵌入式以太网控制器; Supplier Part: C32843; Manufacturer: WIZNET; Supplier Footprint: LQFP-48(7x7); JLCPCB Part Class: Extended Part; Datasheet: https://atta.szlcsc.com/upload/public/pdf/source/20230714/E10C32B058E0BA54FCE1C1556BE10C07.pdf; Supplier: LCSC
X2 = 7E25000E20UCG: Crystal Type:贴片晶振 Frequency: Normal temperature Frequency Tolerance:±10ppm Normal temperature Frequency Tolerance:±10ppm External load capacitor: Frequency Stability(Full temperature range):±30ppm Frequency Stability(Full temperature range):±30ppm Operati; LCSC Part Name: 25MHz ±10ppm 20pF; Supplier Part: C252264; Manufacturer: SJK(晶科鑫); Supplier Footprint: SMD2520-4P; JLCPCB Part Class: Extended Part; Datasheet: https://atta.szlcsc.com/upload/public/pdf/source/20220727/ADD733D11A6D8A7F7FC37A00C6182A2C.pdf; Supplier: LCSC; Crystal Type: 贴片晶振; Normal temperature Frequency Tolerance: ±10ppm; Frequency Stability(Full temperature range): ±30ppm
D2 = 1N4148W_C81598: Diode Configuration: Forward Voltage (Vf@If):1V@50mA Reverse Voltage (Vr): Average Rectified Current (Io): Power Dissipation: Reverse Leakage Current:1uA@75V Reverse Recovery Time (trr): Operating Temperature:- Operating Temperature:-; LCSC Part Name: 电压:75V 电流:150mA; Supplier Part: C81598; Manufacturer: ST(先科); Supplier Footprint: SOD-123; JLCPCB Part Class: Basic Part; Datasheet: https://atta.szlcsc.com/upload/public/pdf/source/20161024/1477288446905.pdf; Supplier: LCSC; Forward Voltage (Vf@If): 1V@50mA; Reverse Leakage Current: 1uA@75V
DS1 DS2 = KT-0603R: Emitted Color:Red Power Dissipation:- Forward Current:- Dominant Wavelength:- Dominant Wavelength:- Peak Wavelength:- Diode Configuration:- Lens Color:- Color Temperature:- Color Temperature:- Viewing Angle:- Mounting Sytle:- Operating Temperature:-40℃~+8; LCSC Part Name: 0603 红灯 高亮; Supplier Part: C2286; Manufacturer: KENTO; Supplier Footprint: 0603; JLCPCB Part Class: Basic Part; Datasheet: https://atta.szlcsc.com/upload/public/pdf/source/20160616/1466072038404.pdf; Supplier: LCSC; Emitted Color: Red; Operating Temperature: -40℃~+85℃
R7 R17 R18 = 0603WAF4701T5E: Type:Thick Film Resistors Resistance:4.7kΩ Tolerance:±1% Tolerance:±1% Power(Watts): Overload Voltage (Max): Temperature Coefficient:±100ppm/℃ Temperature Coefficient:±100ppm/℃ Operating Temperature Range:-55℃~+155℃ Operating Temperature Range:-55℃~+155℃; LCSC Part Name: 4.7kΩ ±1% 100mW 厚膜电阻; Supplier Part: C23162; Manufacturer: UNI-ROYAL(厚声); Supplier Footprint: 0603; JLCPCB Part Class: Basic Part; Datasheet: https://atta.szlcsc.com/upload/public/pdf/source/20200306/C422600_1E6D84923E4A46A82E41ADD87F860B5C.pdf; Supplier: LCSC; Type: Thick Film Resistors; Tolerance: ±1%; Temperature Coefficient: ±100ppm/℃; Operating Temperature Range: -55℃~+155℃
R8 = 0603WAF4700T5E: Type:Thick Film Resistors Resistance: Tolerance:±1% Tolerance:±1% Power(Watts): Overload Voltage (Max): Temperature Coefficient:±100ppm/℃ Temperature Coefficient:±100ppm/℃ Operating Temperature Range:-55℃~+155℃ Operating Temperature Range:-55℃~+155℃; LCSC Part Name: 470Ω ±1% 100mW 厚膜电阻; Supplier Part: C23179; Manufacturer: UNI-ROYAL(厚声); Supplier Footprint: 0603; JLCPCB Part Class: Basic Part; Datasheet: https://atta.szlcsc.com/upload/public/pdf/source/20200306/C422600_1E6D84923E4A46A82E41ADD87F860B5C.pdf; Supplier: LCSC; Type: Thick Film Resistors; Tolerance: ±1%; Temperature Coefficient: ±100ppm/℃; Operating Temperature Range: -55℃~+155℃
U1-U7 U18 = SN74LVC1G17DBVR: Input type:Schmitt Trigger output type:推挽 Supply Voltage:1.65V~5.5V Supply Voltage:1.65V~5.5V Number of Elements:1 Number of Bits per Element:1 Sink Current:32mA Source Current:32mA Logic Family:74LVC Operating Temperature:-40℃~+125℃ Operating Temperature; Supplier Part: C7836; Manufacturer: TI(德州仪器); Supplier Footprint: SOT-23-5; JLCPCB Part Class: Extended Part; Datasheet: https://www.ti.com/cn/lit/gpn/sn74lvc1g17; Supplier: LCSC; Input type: Schmitt Trigger; output type: 推挽; Supply Voltage: 1.65V~5.5V; Number of Elements: 1; Number of Bits per Element: 1; Sink Current: 32mA; Source Current: 32mA; Logic Family: 74LVC; Operating Temperature: -40℃~+125℃; NO_CONNECT: yes
U8 = ATTINY3216-SNR_C609661: CPU Core:AVR Program Storage Size:32KB GPIO Ports Number:18 Operating Voltage Range:1.8V~5.5V Operating Voltage Range:1.8V~5.5V CPU Maximum Speed:20MHz Program Memory Type:FLASH Operating Temperature Range:-40℃~+105℃ Operating Temperature Range:-40℃~+105℃; Supplier Part: C609661; Manufacturer: MICROCHIP(美国微芯); Supplier Footprint: SOIC-20-300mil; JLCPCB Part Class: Extended Part; Datasheet: https://atta.szlcsc.com/upload/public/pdf/source/20221017/C07D66C14B922F573E9000C75FCA8F84.pdf; Supplier: LCSC; CPU Core: AVR; Program Storage Size: 32KB; GPIO Ports Number: 18; Operating Voltage Range: 1.8V~5.5V; CPU Maximum Speed: 20MHz; Program Memory Type: FLASH; Operating Temperature Range: -40℃~+105℃; ADC (Bit): 10bit; DAC (Bit): 8bit; Peripheral/Function: WDT；PWM; Internal Oscillator: 有
U9 U10 U15 = CH340C: Applications Function:Transceiver Protocol: Supply Voltage:3.3V；5V Supply Voltage:3.3V；5V Data Rate:2Mbps; LCSC Part Name: CH340C USB转串口芯片 CH340; Supplier Part: C84681; Manufacturer: WCH(南京沁恒); Supplier Footprint: SOP-16; JLCPCB Part Class: Extended Part; Datasheet: https://atta.szlcsc.com/upload/public/pdf/source/20200819/C84681_ADBED554CE321879DBD6B1D06488689C.pdf; Supplier: LCSC; Applications Function: Transceiver; Supply Voltage: 3.3V；5V; Data Rate: 2Mbps
D1 = SM4007PL_C64898: Diode Configuration: Forward Voltage (Vf@If):1.1V@1A Reverse Voltage (Vr): Average Rectified Current (Io): Reverse Leakage Current:10uA@1kV; LCSC Part Name: 电压:1kV 电流:1A; Supplier Part: C64898; Manufacturer: MDD; Supplier Footprint: SOD-123FL; JLCPCB Part Class: Basic Part; Datasheet: https://atta.szlcsc.com/upload/public/pdf/source/20230823/16A8FDE162764C9B685A3717F2DA3690.pdf; Supplier: LCSC; Forward Voltage (Vf@If): 1.1V@1A; Reverse Leakage Current: 10uA@1kV
J1-J3 = DB127S-3.5-4P-GN: Supplier Part: C2997511; Manufacturer: DORABO(地博电气); Supplier Footprint: P=3.5mm; JLCPCB Part Class: Extended Part; Datasheet: https://atta.szlcsc.com/upload/public/pdf/source/20230321/6E5ECCC48AC3F659D47B8FFA640B550A.pdf; Supplier: LCSC
LS1 = MLT-8540: Oscillator Circuit:无源(外部驱动) Technology Type:电磁式 Operating Voltage:2.5V~4.5V Operating Voltage:2.5V~4.5V Frequency:2.7kHz Current Consumption:- Sound Pressure Level (SPL):80dB@5V,10cm Diameter (φD):- Length:8.7mm Width:8.7mm Height:4mm Operating Temperatur; Supplier Part: C95300; Manufacturer: 华能; Supplier Footprint: SMD,8.7x8.7mm; JLCPCB Part Class: Extended Part; Datasheet: https://atta.szlcsc.com/upload/public/pdf/source/20170522/1495448323732.pdf; Supplier: LCSC; Oscillator Circuit: 无源(外部驱动); Technology Type: 电磁式; Operating Voltage: 2.5V~4.5V; Sound Pressure Level (SPL): 80dB@5V,10cm; Length: 8.7mm; Width: 8.7mm; Height: 4mm
R1 R3-R6 = 0603WAF1003T5E: Type:Thick Film Resistors Resistance:100kΩ Tolerance:±1% Tolerance:±1% Power(Watts): Overload Voltage (Max): Temperature Coefficient:±100ppm/℃ Temperature Coefficient:±100ppm/℃ Operating Temperature Range:-55℃~+155℃ Operating Temperature Range:-55℃~+155℃; LCSC Part Name: 100kΩ ±1% 100mW 厚膜电阻; Supplier Part: C25803; Manufacturer: UNI-ROYAL(厚声); Supplier Footprint: 0603; JLCPCB Part Class: Basic Part; Datasheet: https://atta.szlcsc.com/upload/public/pdf/source/20200306/C422600_1E6D84923E4A46A82E41ADD87F860B5C.pdf; Supplier: LCSC; Type: Thick Film Resistors; Tolerance: ±1%; Temperature Coefficient: ±100ppm/℃; Operating Temperature Range: -55℃~+155℃
SW1 SW2 = K9-1267F: Type:Micro Switch Circuit:SPDT Switch Length:12.7mm Switch Width:5.7mm Switch Height:12.8mm Contact Current (DC):100mA Voltage Rating (DC):30V Contact Current (AC):1A Voltage Rating (AC):125V Mechanical Life:300万次 Operating Temperature:-25℃~+85℃ Operating; LCSC Part Name: 12.7*5.7*12.8mm 插件微动开关; Supplier Part: C107263; Manufacturer: 韩国韩荣; Supplier Footprint: 插件; JLCPCB Part Class: Extended Part; Datasheet: https://atta.szlcsc.com/upload/public/pdf/source/20201214/C107263_D9656DE761E5BF43078859A56D7E33A8.pdf; Supplier: LCSC; Type: Micro Switch; Circuit: SPDT; Switch Length: 12.7mm; Switch Width: 5.7mm; Switch Height: 12.8mm; Contact Current (DC): 100mA; Voltage Rating (DC): 30V; Contact Current (AC): 1A; Voltage Rating (AC): 125V; Mechanical Life: 300万次; Operating Temperature: -25℃~+85℃
C22 C31 C33 = CL10A105KB8NNNC: Capacitance: Tolerance:±10% Tolerance:±10% Voltage Rated: Temperature Coefficient:; LCSC Part Name: 1uF ±10% 50V; Supplier Part: C15849; Manufacturer: SAMSUNG(三星); Supplier Footprint: 0603; JLCPCB Part Class: Basic Part; Datasheet: https://atta.szlcsc.com/upload/public/pdf/source/20160218/1457707763339.pdf; Supplier: LCSC; Tolerance: ±10%
J4 = PM254-1-08-W-8.5: Holes Structure:1x8P Pitch:2.54mm Row Spacing:- Circular Hole / Square Hole:Square Holes Mounting Type:Right-Angle Number of Rows:Plugin Number of Holes:8P Current Rating (Max):3A Voltage Rating (Max):- Holes Direction:side Insulation Height:8.5mm Contact; LCSC Part Name: 1x8P 间距:2.54mm 弯插; Supplier Part: C2897390; Manufacturer: HCTL(华灿天禄); Supplier Footprint: 弯插,P=2.54mm; JLCPCB Part Class: Extended Part; Datasheet: https://atta.szlcsc.com/upload/public/pdf/source/20230609/7BA40A3D721268A082DCDEAD4C99131B.pdf; Supplier: LCSC; Holes Structure: 1x8P; Pitch: 2.54mm; Circular Hole / Square Hole: Square Holes; Mounting Type: Right-Angle; Number of Rows: Plugin; Number of Holes: 8P; Current Rating (Max): 3A; Holes Direction: side; Insulation Height: 8.5mm; Contact Material: Copper Alloy; Operating Temperature Range: -40℃~+105℃; Soldering Temperature(Max): 260℃@5S
MP1-MP4 = SMTSO2070CTJ: specifications:M2X7 surface treatment:镀锡 Product Description:- material quality:- model:SMTSO2070CTJ brand:Sinhoo(雄和远景); LCSC Part Name: 雄和远景，电路板表贴圆螺母柱，M2X7，铜镀锡,1个; Supplier Part: C2916355; Manufacturer: Sinhoo(雄和远景); JLCPCB Part Class: Extended Part; Datasheet: https://atta.szlcsc.com/upload/public/pdf/source/20211122/17CF5E24EB4D4DC090A80DE3D7DE5E21.pdf; Supplier: LCSC; specifications: M2X7; surface treatment: 镀锡; brand: Sinhoo(雄和远景)
SW3 = KH-10027B-SMT2.54-6P: Type:平拨,凸起式 Number of Positions:6Bit Pin Style:Gull Wing Lead Pitch:2.54mm Current Rating:100mA Voltage Rating:24V Operating Temperature:-20℃~+70℃ Operating Temperature:-20℃~+70℃ Operating Life:2千次 Color:Black; Supplier Part: C2842912; Manufacturer: kinghelm(金航标); Supplier Footprint: SMD-12P,6.2x16.2mm; JLCPCB Part Class: Extended Part; Datasheet: https://atta.szlcsc.com/upload/public/pdf/source/20210628/C2842912_B7EB6DF420F35ED8011A7DE4CA789B7B.pdf; Supplier: LCSC; Type: 平拨,凸起式; Number of Positions: 6Bit; Pin Style: Gull Wing; Lead Pitch: 2.54mm; Current Rating: 100mA; Voltage Rating: 24V; Operating Temperature: -20℃~+70℃; Operating Life: 2千次; Color: Black
U11 = BL8565CC3BTR33: Output Type: Maximum Input Voltage:6V Output Voltage:3.3V Output Voltage:3.3V MAX Output Current:500mA Power Supply Rejection Ratio (PSRR):70dB@(100Hz) Dropout Voltage:220mV@(300mA) Output Polarity:Positive electrode Number of Outputs:1; LCSC Part Name: 输入6V 输出3.3V 500mA; Supplier Part: C51826; Manufacturer: BL(上海贝岭); Supplier Footprint: SOT-89-3; JLCPCB Part Class: Extended Part; Datasheet: https://atta.szlcsc.com/upload/public/pdf/source/20150618/1457707324228.pdf; Supplier: LCSC; Maximum Input Voltage: 6V; Output Voltage: 3.3V; MAX Output Current: 500mA; Power Supply Rejection Ratio (PSRR): 70dB@(100Hz); Dropout Voltage: 220mV@(300mA); Output Polarity: Positive electrode; Number of Outputs: 1
U12 = ESP32-S2-SOLO-2-N4: Core Processor:ESP32-S2芯片 Support Interface:I2C；GPIO；SPI；PWM；ADC；UART；USB；I2S Frequency:2.4GHz Output Power:19.5dBm Output Power:19.5dBm; Supplier Part: C3040594; Manufacturer: ESPRESSIF(乐鑫); Supplier Footprint: SMD-41P; JLCPCB Part Class: Extended Part; Datasheet: https://atta.szlcsc.com/upload/public/pdf/source/20220829/68E69EF550BFD22B9418B9E05FF4E453.pdf; Supplier: LCSC; Core Processor: ESP32-S2芯片; Support Interface: I2C；GPIO；SPI；PWM；ADC；UART；USB；I2S; Output Power: 19.5dBm
U14 = DS18B20Z: Resolution:±0.4℃ Resolution:±0.4℃ Supply Voltage:2.5V~5.5V Supply Voltage:2.5V~5.5V; LCSC Part Name: 温度传感器; Supplier Part: C695837; Manufacturer: UMW(友台半导体); Supplier Footprint: SOIC-8; JLCPCB Part Class: Extended Part; Datasheet: https://atta.szlcsc.com/upload/public/pdf/source/20231109/DC3DA9D47D486EF40A6E0F08B9A498E3.pdf; Supplier: LCSC; Resolution: ±0.4℃; Supply Voltage: 2.5V~5.5V
J6 = D-SUB-DR-9PCM-CB: Gender:Mother Number of Pins:9P Mounting Style:Bend-in Number of Rows:2 Current Rating-Signal (Max):3A Operating Temperature Range:-50℃~+105℃ Operating Temperature Range:-50℃~+105℃; LCSC Part Name: D-Sub 母 P数:9P; Supplier Part: C19077337; Manufacturer: XUNPU(讯普); Supplier Footprint: 弯插; JLCPCB Part Class: Extended Part; Datasheet: https://atta.szlcsc.com/upload/public/pdf/source/20231108/FB2E8AB0BE4F620DDF3F7F4D0B9AFB97.pdf; Supplier: LCSC; Gender: Mother; Number of Pins: 9P; Mounting Style: Bend-in; Number of Rows: 2; Operating Temperature Range: -50℃~+105℃; Current Rating-Signal (Max): 3A
R24 = 0603WAF5101T5E: Type:Thick Film Resistors Resistance:5.1kΩ Tolerance:±1% Tolerance:±1% Power(Watts): Overload Voltage (Max): Temperature Coefficient:±100ppm/℃ Temperature Coefficient:±100ppm/℃ Operating Temperature Range:-55℃~+155℃ Operating Temperature Range:-55℃~+155℃; LCSC Part Name: 5.1kΩ ±1% 100mW 厚膜电阻; Supplier Part: C23186; Manufacturer: UNI-ROYAL(厚声); Supplier Footprint: 0603; JLCPCB Part Class: Basic Part; Datasheet: https://atta.szlcsc.com/upload/public/pdf/source/20200306/C422600_1E6D84923E4A46A82E41ADD87F860B5C.pdf; Supplier: LCSC; Type: Thick Film Resistors; Tolerance: ±1%; Temperature Coefficient: ±100ppm/℃; Operating Temperature Range: -55℃~+155℃
C36 C39 C40 = CL10A106MA8NRNC: Capacitance: Tolerance:±20% Tolerance:±20% Voltage Rated: Temperature Coefficient:; LCSC Part Name: 10uF ±20% 25V; Supplier Part: C96446; Manufacturer: SAMSUNG(三星); Supplier Footprint: 0603; Datasheet: https://atta.szlcsc.com/upload/public/pdf/source/20170325/1490427913016.pdf; Supplier: LCSC; Tolerance: ±20%
D3 = SRV05-4-P-T7_C85364: Reverse Stand-Off Voltage (Vrwm):5V Breakdown Voltage:6V Peak Pulse Current (Ipp)@10/1000s:1A@8/20us Maximum Clamping Voltage:12V; LCSC Part Name: Vrwm:5V; Supplier Part: C85364; Manufacturer: PROTEK; Supplier Footprint: SOT-23-6; Datasheet: https://atta.szlcsc.com/upload/public/pdf/source/20161024/1477288764689.pdf; Supplier: LCSC; Reverse Stand-Off Voltage (Vrwm): 5V; Breakdown Voltage: 6V; Peak Pulse Current (Ipp)@10/1000μs: 1A@8/20us; Maximum Clamping Voltage: 12V
D4 = SS14_C2480: Diode Configuration:Single Forward Voltage (Vf@If):550mV@1A Reverse Voltage (Vr):40V Average Rectified Current (Io):1A Reverse Leakage Current (Ir):500uA@40V; LCSC Part Name: 电压:40V 电流:1A; Supplier Part: C2480; Manufacturer: MDD; Supplier Footprint: SMA(DO-214AC); JLCPCB Part Class: Basic Part; Datasheet: https://atta.szlcsc.com/upload/public/pdf/source/20230712/2DB6064CFBB99DE6DB116BEE8208BE66.pdf; Supplier: LCSC; Diode Configuration: Single; Forward Voltage (Vf@If): 550mV@1A; Reverse Voltage (Vr): 40V; Average Rectified Current (Io): 1A; Reverse Leakage Current (Ir): 500uA@40V
J5 = U-USBBR04P-F001: Connector Type:Type-B Standard:USB 2.0 Gender:Female Number of Ports:1 Number of Contacts:4P Mounting Style:Right-Angle Current Rating - Power (Max):1.5A Operating Temperature Range:- Operating Temperature Range:-; LCSC Part Name: Type-B 母 弯插; Supplier Part: C386743; Manufacturer: Ckmtw(灿科盟); Supplier Footprint: 插件; JLCPCB Part Class: Extended Part; Datasheet: https://atta.szlcsc.com/upload/public/pdf/source/20190509/C386743_2E7BDE199FB40B6F97679D15D491C286.pdf; Supplier: LCSC; Connector Type: Type-B; Standard: USB 2.0; Gender: Female; Number of Ports: 1; Number of Contacts: 4P; Mounting Style: Right-Angle; Current Rating - Power (Max): 1.5A
R49 R50 = 0603WAF0000T5E: Type:Thick Film Resistors Resistance: Tolerance:±1% Tolerance:±1% Power(Watts): Overload Voltage (Max): Operating Temperature Range:-55℃~+155℃ Operating Temperature Range:-55℃~+155℃; LCSC Part Name: 0Ω ±1% 100mW 厚膜电阻; Supplier Part: C21189; Manufacturer: UNI-ROYAL(厚声); Supplier Footprint: 0603; JLCPCB Part Class: Basic Part; Datasheet: https://atta.szlcsc.com/upload/public/pdf/source/20200306/C422600_1E6D84923E4A46A82E41ADD87F860B5C.pdf; Supplier: LCSC; Type: Thick Film Resistors; Tolerance: ±1%; Operating Temperature Range: -55℃~+155℃
U16 = SL2.1A: Applications Function: Protocol:; Supplier Part: C192893; Manufacturer: CoreChips(和芯润德); Supplier Footprint: SOP-16; JLCPCB Part Class: Extended Part; Datasheet: https://atta.szlcsc.com/upload/public/pdf/source/20180522/C192893_624110D24898D57AAC785E3DF98EA862.pdf; Supplier: LCSC
X1 = X322512MSB4SI: Crystal Type:SMD Crystal Resonator Frequency: Frequency Tolerance:±10ppm Frequency Tolerance:±10ppm Frequency Stability:±30ppm Frequency Stability:±30ppm Load Capacitance: Operating Temperature: Operating Temperature:; LCSC Part Name: 12MHz ±10ppm 20pF; Supplier Part: C9002; Manufacturer: YXC(扬兴晶振); Supplier Footprint: SMD3225-4P; JLCPCB Part Class: Basic Part; Datasheet: https://atta.szlcsc.com/upload/public/pdf/source/20210329/C112971_1F611BDC486E193C1706F6D8EB5AA189.pdf; Supplier: LCSC; Crystal Type: SMD Crystal Resonator; Frequency Tolerance: ±10ppm; Frequency Stability: ±30ppm

## Nets
+5V: C1.1 C2.2 C3.2 C5.1 C9.2 C11.2 C12.2 C14.2 C15.2 C16.2 C17.2 C18.2 C19.2 C22.2 C25.1 C26.2 C36.2 C42.1 C43.2 C45.1 D1.1(C) D4.1(K) J1.4 LS1.1(+) R1.2 R3.2 R4.1 R5.1 R6.1 SW3.4 SW3.5 SW3.6 U1.5(VCC) U2.5(VCC) U3.5(VCC) U4.5(VCC) U5.5(VCC) U7.5(VCC) U8.1(VDD) U9.16(VCC) U10.16(VCC) U11.2(VIN) U13.5(VIN) U16.11(VDD5) U18.5(VCC) U19.1(VOUT) U20.4(VCC) U22.5(VIN)
AVDD: C49.2 C50.2 C51.2 C52.2 C53.2 C54.2 C55.2 FB2.2 R42.2 R43.2 R44.2 U23.4(AVDD) U23.8(AVDD) U23.11(AVDD) U23.15(AVDD) U23.17(AVDD) U23.21(AVDD)
GND: C1.2 C2.1 C3.1 C4.1 C5.2 C6.1 C7.1 C8.1 C9.1 C10.2 C11.1 C12.1 C13.1 C14.1 C15.1 C16.1 C17.1 C18.1 C19.1 C20.1 C21.1 C22.1 C24.1 C25.2 C26.1 C27.1 C28.1 C29.1 C30.1 C31.1 C32.1 C33.1 C34.1 C35.1 C36.1 C37.1 C38.2 C39.1 C40.1 C41.2 C42.2 C43.1 C44.1 C45.2 C46.2 C47.1 C48.1 C49.1 C50.1 C51.1 C52.1 C53.1 C54.1 C55.1 C56.2 C57.1 C58.1 C59.2 C62.1 C63.1 D3.2 DS1.1(K) DS2.1(K) J1.1 J2.2 J2.3 J3.4 J4.3 J5.4(GND) J5.5(SHLD) J5.6(SHLD) J6.3 J6.5 J7.8 J7.13(SHELL) Q1.2(E) Q4.2(E) R9.1 R10.1 R11.1 R12.1 R14.1 R15.1 R16.2 R23.2 R25.2 R26.2 R31.1 R32.1 R33.1 R34.1 R35.1 R37.1 R41.2 SW1.1(C) SW2.1(C) U1.3(GND) U2.3(GND) U3.3(GND) U4.3(GND) U5.3(GND) U6.3(GND) U7.3(GND) U8.20(GND) U9.1(GND) U10.1(GND) U11.1(VSS) U12.1(GND) U12.40(GND) U12.41(GND) U13.2(GND) U14.5(GND) U15.1(GND) U16.12(GND) U17.2(GND) U18.3(GND) U19.2(GND) U20.1(GND) U21.3(GND) U22.2(GND) U23.3(AGND) U23.9(AGND) U23.14(AGND) U23.16(AGND) U23.19(AGND) U23.29(GND) U23.48(AGND) X1.2(GND) X1.4(GND) X2.2(GND) X2.4(GND)
VCC: C13.2 C27.2 C28.2 C29.2 C30.2 C31.2 C32.2 C46.1 FB1.1 FB2.1 R13.2 R18.2 R21.2 R22.2 R24.2 R28.1 R29.1 R30.1 R36.1 R38.1 R39.1 SW3.1 SW3.2 SW3.3 U6.5(VCC) U11.3(VOUT) U12.2(3V3) U14.3(VDD) U15.4(V3) U15.16(VCC) U21.5(VCC)
VDD: C47.2 C48.2 FB1.2 U23.28(VDD)
BUTTON: U4.4(Y) U8.6(PB5)
BUZZER: R2.1 U8.19(PA3/EXTCLK)
DB9_INT: J6.7 R13.1 U12.30(IO37)
DEBUG_LED: R17.2 U12.8(IO15)
DIP1: R15.2 SW3.12 U12.18(IO10)
DIP2: R14.2 SW3.11 U12.19(IO11)
DIP3: R12.2 SW3.10 U12.20(IO12)
DIP4: R11.2 SW3.9 U8.4(PA6)
DIP5: R10.2 SW3.8 U8.3(PA5)
DN: D3.1 D3.6 J5.2(D-) R50.1 U16.9(DM)
DN1: R50.2 U15.6(D-) U16.1(DM4)
DN2: U10.6(D-) U16.5(DM2)
DN3: U9.6(D-) U16.3(DM3)
DP: D3.3 D3.4 J5.3(D+) R49.1 U16.10(DP)
DP1: R49.2 U15.5(D+) U16.2(DP4)
DP2: U10.5(D+) U16.6(DP2)
DP3: U9.5(D+) U16.4(DP3)
DTR: Q3.2(E) R19.1 U15.13(DTR#)
EN: C33.2 C35.2 Q2.3(C) R21.1 U12.3(EN)
ESP_RX: U12.36(RXD0) U15.2(TXD)
ESP_TX: U12.37(TXD0) U15.3(RXD)
ETH_CS: R39.2 U12.15(IO3) U21.1(OE) U23.32(SCSn)
ETH_INT: R38.2 U12.21(IO13) U23.36(INTn)
ETH_LEDs: U12.33(IO40) U22.4(EN)
ETH_RST: R27.2 U12.14(IO20)
FE_DEBUG: R7.2 U8.15(PC3)
GPIO0: C34.2 Q3.3(C) U12.27(IO0)
HV_RX: U7.4(Y) U8.18(PA2)
HV_TX: U6.2(A) U8.17(PA1)
INT_TOESP: U6.4(Y) U12.13(IO19)
INT_TOTINY: U7.2(A) U12.17(IO9)
IO18: R22.1 U12.11(IO18)
KEY1: U5.4(Y) U8.7(PB4)
KEY2: U3.4(Y) U8.10(PB1)
LED_DATA: J1.3 U8.13(PC1)
MISO: J4.7 U12.9(IO16) U21.4(Y)
MOSI: J4.6 U12.7(IO7) U23.35(MOSI)
NFC_CS: J4.5 U12.6(IO6)
NFC_IRQ: J4.2 U12.5(IO5)
NFC_PWR: U12.12(IO8) U13.4(EN)
NFC_RSTO: J4.1 U12.4(IO4)
NO: U8.11(PB0) U18.2(A)
NO_HP: J6.1 U18.4(Y)
RTS: Q2.2(E) R20.1 U15.14(RTS#)
RXN: C61.2 R48.2 U23.5(RXN)
RXP: C60.2 R47.2 U23.6(RXP)
SCK: J4.8 U12.10(IO17) U23.33(SCLK)
SW_TYPE: J6.6 R24.1 U12.38(IO2)
SWITCH1: U1.4(Y) U8.14(PC2)
SWITCH2: U2.4(Y) U8.12(PC0)
TEMP: J6.2 R18.1 U12.39(IO1) U14.4(DQ)
TINY_RX: U8.8(TOSC1/PB3) U9.2(TXD)
TINY_TX: U8.9(TOSC2/PB2) U9.3(RXD)
TXN: J7.2 R43.1 U23.1(TXN)
TXP: J7.1 R42.1 U23.2(TXP)
UART_MODE: R9.2 SW3.7 U8.2(PA4)
UPDI: R8.1 U8.16(PA0/RESET#/UPDI)
VLED: C44.2 R45.2 R46.2 U22.1(VOUT)
VNFC: C24.2 J4.4 U13.1(VOUT)
VSW: C41.1 J6.4 U19.4(EN) U19.5(VIN)
VUSB: C38.1 D3.5 J5.1(VCC) U17.4(EN) U17.5(VIN)
W_ACT: J7.11(D3+) U23.27(ACTLED)
W_LINK: J7.10(D2-) U23.25(LINKLED)
W_MISO: U21.2(A) U23.34(MISO)
W_RST: R36.2 U20.3(MR#) U23.37(RSTn)
W_XI: C59.1 R40.1 U23.30(XI/CLKIN) X2.3(OSC2)
W_XO: C56.1 R40.2 U23.31(XO) X2.1(OSC1)
$1N8540: DS2.2(A) R17.1
$1N32140: R16.1 U13.3(SET)
$1N32545: Q3.1(B) R20.2
$1N32546: Q2.1(B) R19.2
$3N29171: C7.2 J2.4 R5.2 U3.2(A)
$3N29172: C10.1 J2.1 R6.2 U5.2(A)
$3N32501: C8.2 J3.3 R4.2 U4.2(A)
$3N35905: Q1.1(B) R2.2
$3N35907: D1.2(A) LS1.2 Q1.3(C)
$3N41245: C6.2 R3.1 SW2.2(NO) U2.2(A)
$3N41285: C4.2 R1.1 SW1.2(NO) U1.2(A)
$4N1194: C37.2 D4.2(A) U17.1(VOUT)
$4N1196: R23.1 U17.3(SET)
$4N3426: U16.16(XIN) X1.3(OSC2)
$4N3427: U16.15(XOUT) X1.1(OSC1)
$4N3429: C39.2 U16.13(VDD33)
$4N3431: C40.2 U16.14(VDD18)
$5N738: R25.1 U19.3(SET)
$7N563: R26.1 U22.3(SET)
$7N1020: R28.2 U23.45(PMODE0)
$7N1025: R29.2 U23.44(PMODE1)
$7N1030: R30.2 U23.43(PMODE2)
$7N1212: R31.2 U23.42(RSVD)
$7N1216: R32.2 U23.41(RSVD)
$7N1220: R33.2 U23.40(RSVD)
$7N1225: R34.2 U23.39(RSVD)
$7N1267: R35.2 U23.38(RSVD)
$7N2484: R41.1 U23.23(RSVD)
$7N2526: C58.2 U23.22(1V2O)
$7N2585: C57.2 U23.20(TOCAP)
$7N2734: R37.2 U23.10(EXRES1)
$7N3542: J7.9(D1+) R46.1
$7N3923: C62.2 J7.4 R44.1
$7N3940: C60.1 J7.3
$7N4100: C63.2 J7.5 R47.1 R48.1
$7N4138: C61.1 J7.6
$7N5537: J7.12(D4-) R45.1
$7N6987: Q4.1(B) R27.1
$7N7003: Q4.3(C) U20.2(RESET#)
$8N1418: D2.2(A) R8.2 U10.3(RXD)
$8N1425: D2.1(K) U10.2(TXD)
$8N2039: C20.2 U9.4(V3)
$8N2042: C21.2 U10.4(V3)
$8N4459: DS1.2(A) R7.1

Not connected (* = marked no-connect by the designer): C23 1 2; J1 2*; J3 1* 2*; J6 8* 9* 10(MH1)* 11(MH2)*; J7 7*; LS1 3(NC)* 4(NC)*; MP1 1* 2* 3* 4*; MP2 1* 2* 3* 4*; MP3 1* 2* 3* 4*; MP4 1* 2* 3* 4*; SW1 3(NC)*; SW2 3(NC)*; U1 1(N.C)*; U2 1(N.C)*; U3 1(N.C)*; U4 1(N.C)*; U5 1(N.C)*; U6 1(N.C)*; U7 1(N.C)*; U8 5(PA7)*; U9 7(NC.)* 8(OUT#)* 9(CTS#)* 10(DSR#)* 11(RI#)* 12(DCD#)* 13(DTR#)* 14(RTS#)* 15(R232)*; U10 7(NC.)* 8(OUT#)* 9(CTS#)* 10(DSR#)* 11(RI#)* 12(DCD#)* 13(DTR#)* 14(RTS#)* 15(R232)*; U12 16(IO46)* 22(IO14)* 23(IO21)* 24(IO33)* 25(IO34)* 26(IO45)* 28(IO35)* 29(IO36)* 31(IO38)* 32(IO39)* 34(IO41)* 35(IO42)*; U14 1(NC)* 2(NC)* 6(NC)* 7(NC)* 8(NC)*; U15 7(NC.)* 8(OUT#)* 9(CTS#)* 10(DSR#)* 11(RI#)* 12(DCD#)* 15(R232)*; U16 7(DM1)* 8(DP1)*; U18 1(N.C)*; U23 7(DNC)* 12(NC)* 13(NC)* 18(VBG)* 24(SPDLED)* 26(DUPLED)* 46(NC)* 47(NC)*

## Notes on the sheets
sheet 1
- UART Bootstrapping
- Microcontroller
- 3.3v Regulator
- Bootstrapping Pin Dampening
- Configuration DIP Switches
- Configuration DIP Switches:
- 1: System Mode (Sign In or Machine Core)
- 2: Reserved (WiFi Off)
- 3: Reserved (Ethernet Off)
- 4: Reserved (Bluetooth Mode)
- 5: Buzzer On/Off
- 6: AtTiny UART Mode (Debug)
- Mounting Hardware
- ESP Bias Resistors
- NFC Card Reader Connection
- Bulk Capacitance
- Temperature Sensor
- ESP32 USB-UART Bridge
- C2894950 on NFC Reader
- NFC Power Switch
- Debug LED
- Intended for use with:
  Elechouse PN532 V4 or comparable
sheet 2
- Card Presence Detectors with Hardware Debounce
- Key Switch Connection & Debounce
- Button & Debounce
- Passive Buzzer
- Key switch logic:
- Pos 1: Off
- Pos 2: 1-2
- Pos 3: 3-4
sheet 3
- USB ESD Protection
- USB Hub IC
- Lite Edition USB Bypasses
- USB Plug and Current Limiting
- Removed from Lite Edition
sheet 4
- Switch Connector
- Switch Current Limiting
- Switch Output Line Driver
sheet 5
- LED Power Switch
- MISO Tri-State Buffer
- Reset Controller
- Ethernet MAC+PHY
- Power Conditioning
- Ethernet Mag-Jack
- Ethernet hardware is not present in the Lite edition ACS Core
sheet 6
- Debug LED
- Integrated UPDI Programmer
- UART 3.3v to 5v Level Shifting
- Removed from Lite Edition
- Microcontroller
- AtTiny Debug UART
- Removed from Lite Edition
- If UART_MODE is high, AtTiny re-assigns location of RX/TX to communicate with ESP32.
  By default and/or with no special code running, UART goes to USB
